# EAGLE design display driver rev B (EAGLE 9.6.1)
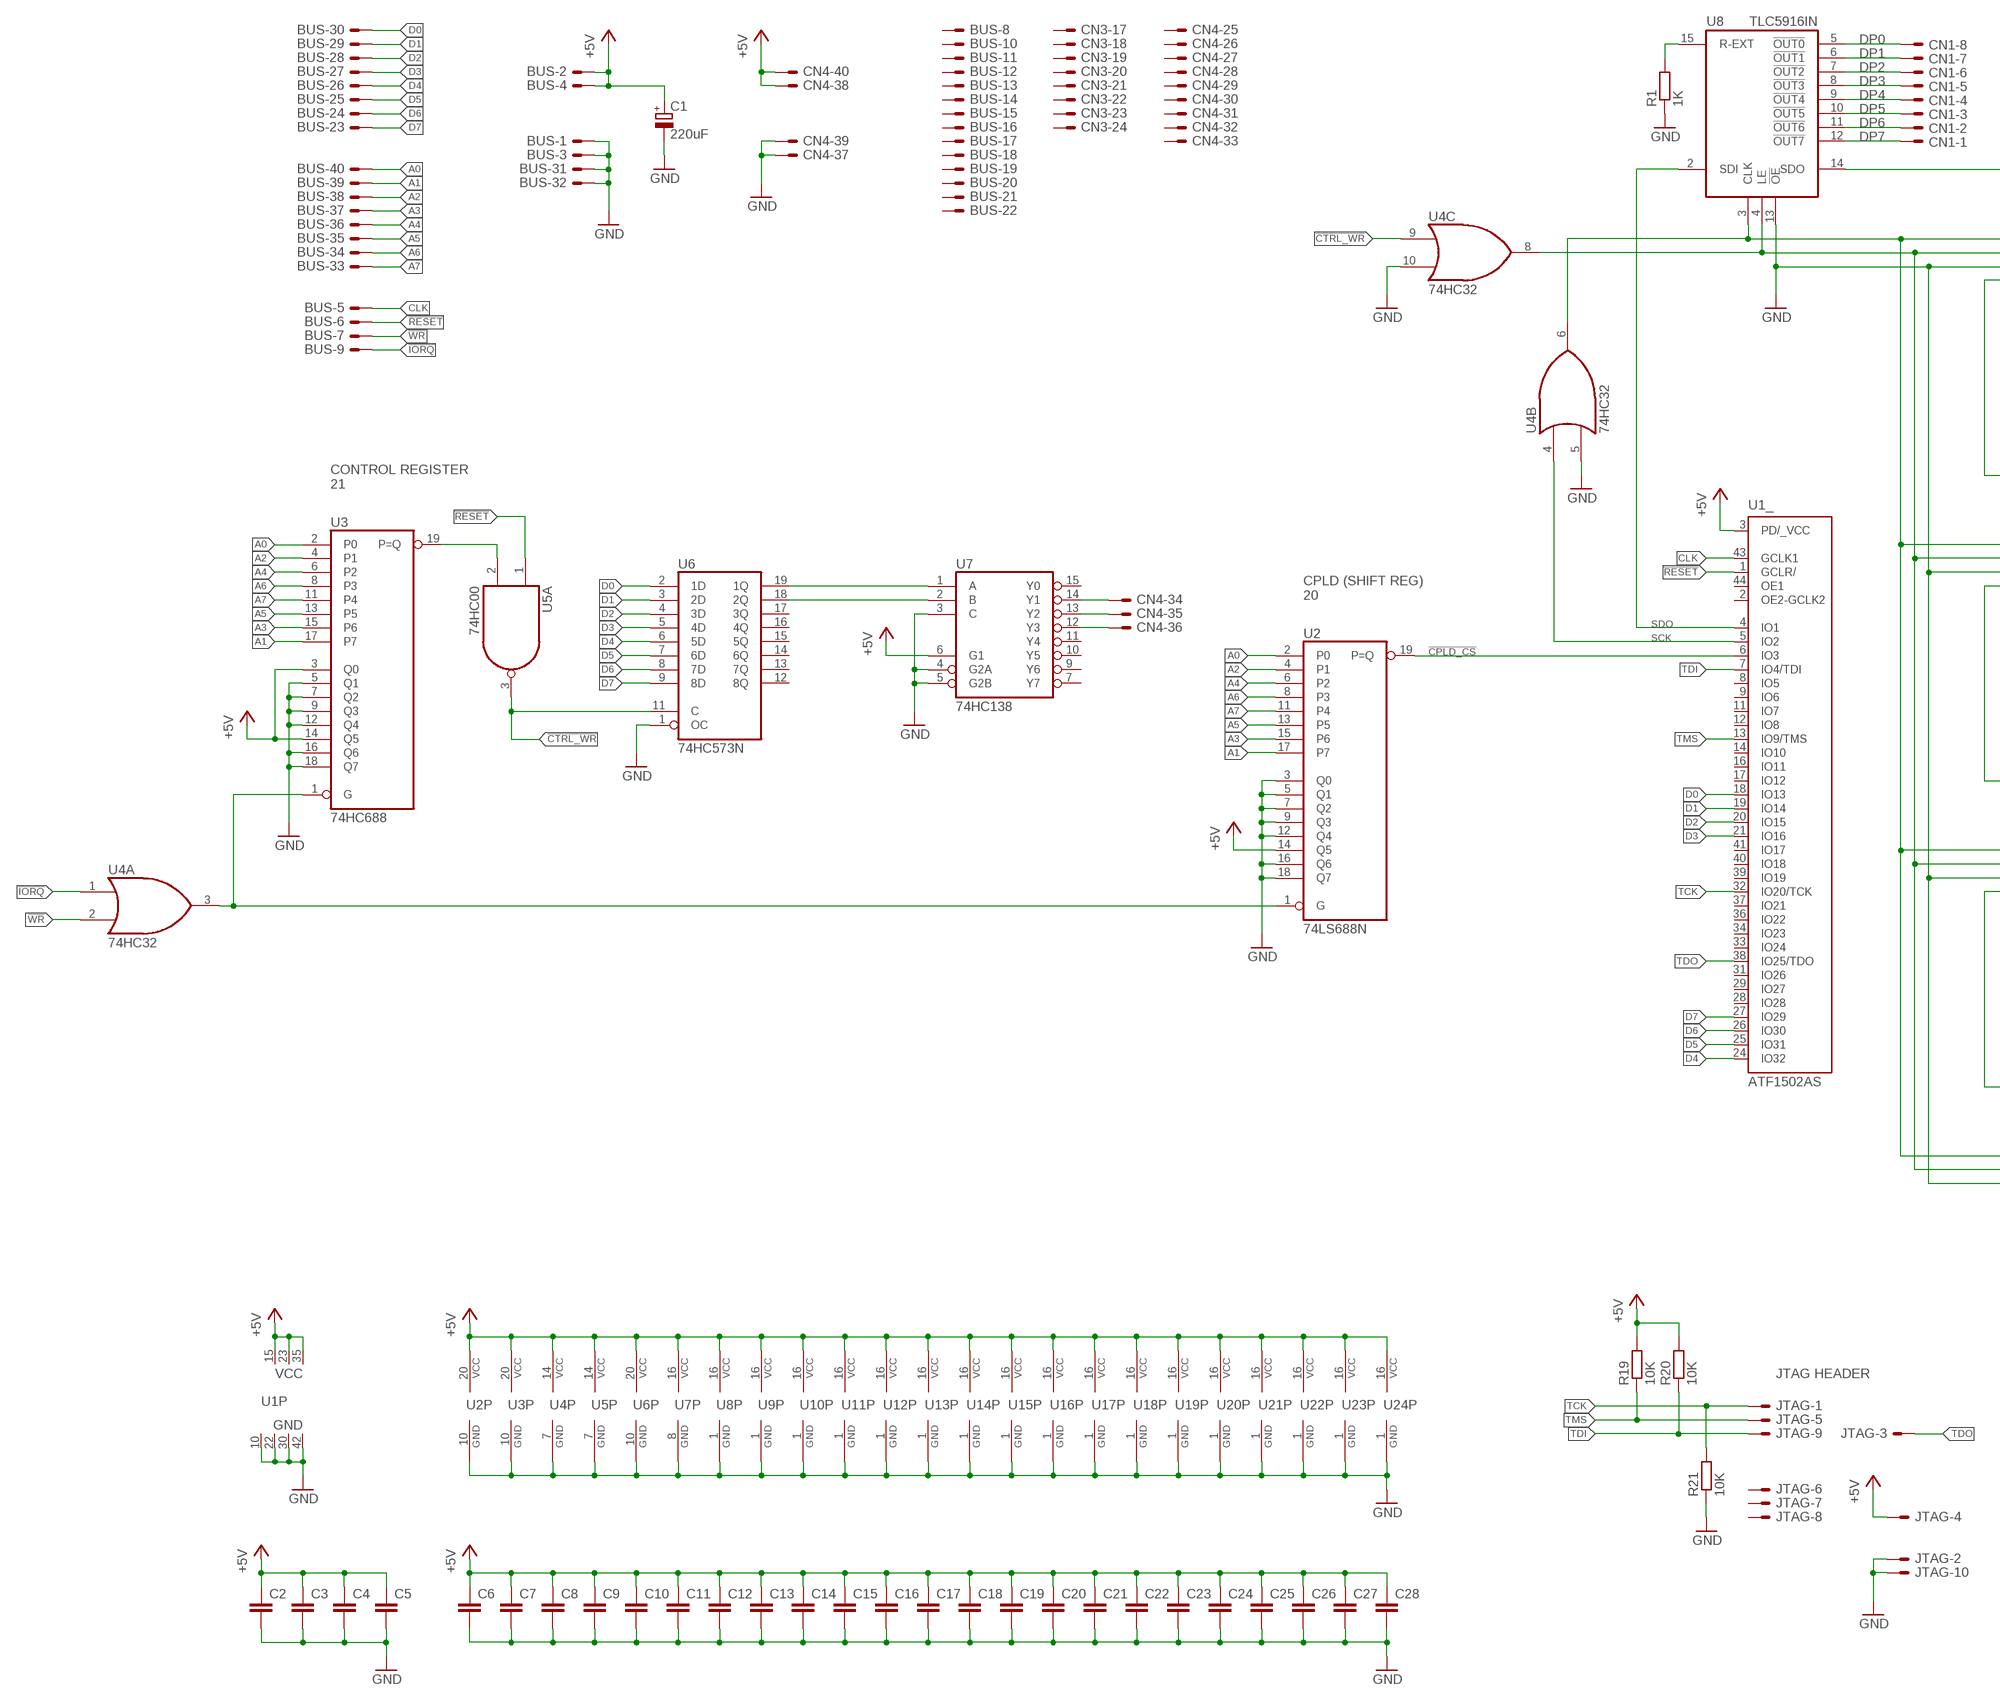
[diagram p0: schematic, sheet 1, part 1 of 2]
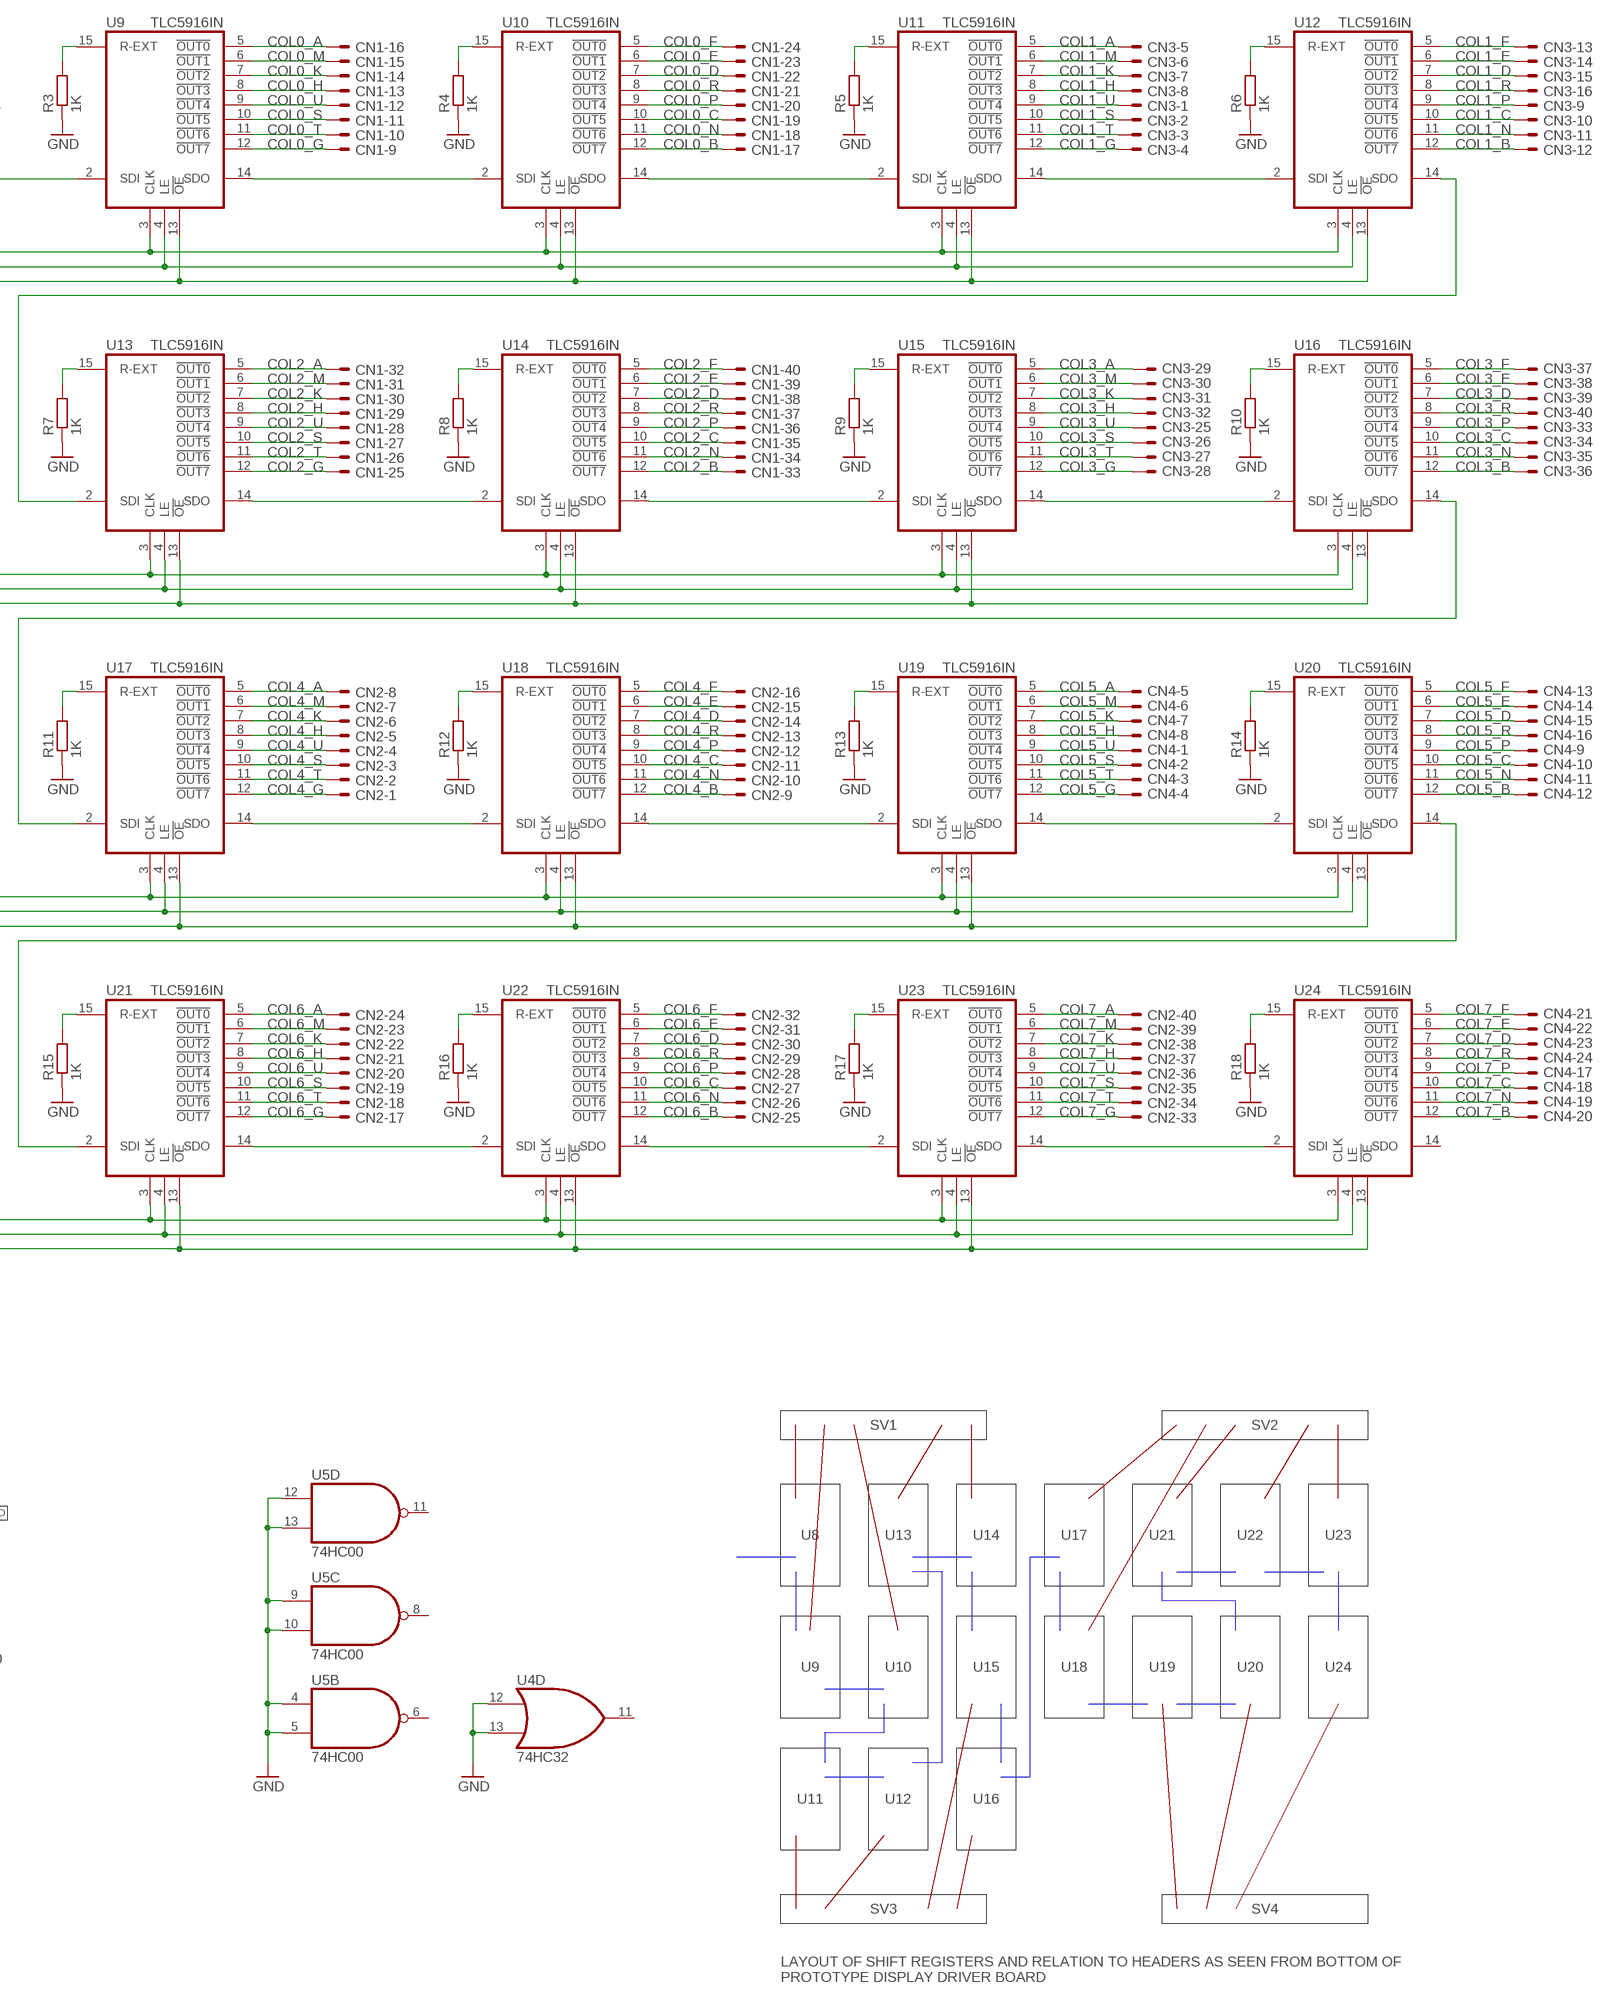
[diagram p1: schematic, sheet 1, part 2 of 2]

## Parts
BUS  HDR40  [HDR40]
C1  220uF  CPOL-EUE3.5-8  [E3,5-8]
C2  C-EU050-025X075  [C050-025X075]
C3  C-EU050-025X075  [C050-025X075]
C4  C-EU050-025X075  [C050-025X075]
C5  C-EU050-025X075  [C050-025X075]
C6  C-EU050-025X075  [C050-025X075]
C7  C-EU050-025X075  [C050-025X075]
C8  C-EU050-025X075  [C050-025X075]
C9  C-EU050-025X075  [C050-025X075]
C10  C-EU050-025X075  [C050-025X075]
C11  C-EU050-025X075  [C050-025X075]
C12  C-EU050-025X075  [C050-025X075]
C13  C-EU050-025X075  [C050-025X075]
C14  C-EU050-025X075  [C050-025X075]
C15  C-EU050-025X075  [C050-025X075]
C16  C-EU050-025X075  [C050-025X075]
C17  C-EU050-025X075  [C050-025X075]
C18  C-EU050-025X075  [C050-025X075]
C19  C-EU050-025X075  [C050-025X075]
C20  C-EU050-025X075  [C050-025X075]
C21  C-EU050-025X075  [C050-025X075]
C22  C-EU050-025X075  [C050-025X075]
C23  C-EU050-025X075  [C050-025X075]
C24  C-EU050-025X075  [C050-025X075]
C25  C-EU050-025X075  [C050-025X075]
C26  C-EU050-025X075  [C050-025X075]
C27  C-EU050-025X075  [C050-025X075]
C28  C-EU050-025X075  [C050-025X075]
CN1  HDR40  [HDR40]
CN2  HDR40  [HDR40]
CN3  HDR40  [HDR40]
CN4  HDR40  [HDR40]
JTAG  ML10E  [ML10]
R1  1K  R-EU_0207/10  [0207/10]
R3  1K  R-EU_0207/10  [0207/10]
R4  1K  R-EU_0207/10  [0207/10]
R5  1K  R-EU_0207/10  [0207/10]
R6  1K  R-EU_0207/10  [0207/10]
R7  1K  R-EU_0207/10  [0207/10]
R8  1K  R-EU_0207/10  [0207/10]
R9  1K  R-EU_0207/10  [0207/10]
R10  1K  R-EU_0207/10  [0207/10]
R11  1K  R-EU_0207/10  [0207/10]
R12  1K  R-EU_0207/10  [0207/10]
R13  1K  R-EU_0207/10  [0207/10]
R14  1K  R-EU_0207/10  [0207/10]
R15  1K  R-EU_0207/10  [0207/10]
R16  1K  R-EU_0207/10  [0207/10]
R17  1K  R-EU_0207/10  [0207/10]
R18  1K  R-EU_0207/10  [0207/10]
R19  10K  R-EU_0207/10  [0207/10]
R20  10K  R-EU_0207/10  [0207/10]
R21  10K  R-EU_0207/10  [0207/10]
U1  ATF1502AS  EPM7032S44  [PLCC-S44]
U2  74LS688N  [DIL20]
U3  74HC688  74LS688N  [DIL20]
U4  74HC32  74LS32N  [DIL14]
U5  74HC00  74LS00N  [DIL14]
U6  74HC573N  [DIL20]
U7  74HC138  74LS138N  [DIL16]
U8  TLC5916IN  [DIL16]
U9  TLC5916IN  [DIL16]
U10  TLC5916IN  [DIL16]
U11  TLC5916IN  [DIL16]
U12  TLC5916IN  [DIL16]
U13  TLC5916IN  [DIL16]
U14  TLC5916IN  [DIL16]
U15  TLC5916IN  [DIL16]
U16  TLC5916IN  [DIL16]
U17  TLC5916IN  [DIL16]
U18  TLC5916IN  [DIL16]
U19  TLC5916IN  [DIL16]
U20  TLC5916IN  [DIL16]
U21  TLC5916IN  [DIL16]
U22  TLC5916IN  [DIL16]
U23  TLC5916IN  [DIL16]
U24  TLC5916IN  [DIL16]

## Nets
!CPLD_CS!: U1.6(_:IO3) U2.19(P=Q)
!CTRL_WR!: U4.9(C:I0) U5.3(A:O) U6.11(C)
!IORQ!: BUS.9 U4.1(A:I0)
!RESET!: BUS.6 U1.1(_:GCLR/) U5.1(A:I0)
!WR!: BUS.7 U4.2(A:I1)
+5V: BUS.2 BUS.4 C1.+ C2.1 C3.1 C4.1 C5.1 C6.1 C7.1 C8.1 C9.1 C10.1 C11.1 C12.1 C13.1 C14.1 C15.1 C16.1 C17.1 C18.1 C19.1 C20.1 C21.1 C22.1 C23.1 C24.1 C25.1 C26.1 C27.1 C28.1 CN4.38 CN4.40 JTAG.4 R19.2 R20.2 U1.3(_:PD/_VCC) U1.15(P:VCC) U1.23(P:VCC) U1.35(P:VCC) U2.14(Q5) U2.20(VCC) U3.3(Q0) U3.14(Q5) U3.20(VCC) U4.14(P:VCC) U5.14(P:VCC) U6.20(VCC) U7.6(G1) U7.16(VCC) U8.16(VCC) U9.16(VCC) U10.16(VCC) U11.16(VCC) U12.16(VCC) U13.16(VCC) U14.16(VCC) U15.16(VCC) U16.16(VCC) U17.16(VCC) U18.16(VCC) U19.16(VCC) U20.16(VCC) U21.16(VCC) U22.16(VCC) U23.16(VCC) U24.16(VCC)
A0: BUS.40 U2.2(P0) U3.2(P0)
A1: BUS.39 U2.17(P7) U3.17(P7)
A2: BUS.38 U2.4(P1) U3.4(P1)
A3: BUS.37 U2.15(P6) U3.15(P6)
A4: BUS.36 U2.6(P2) U3.6(P2)
A5: BUS.35 U2.13(P5) U3.13(P5)
A6: BUS.34 U2.8(P3) U3.8(P3)
A7: BUS.33 U2.11(P4) U3.11(P4)
CLK: BUS.5 U1.43(_:GCLK1)
COL0_A: CN1.16 U9.5(!OUT0!)
COL0_B: CN1.17 U10.12(!OUT7!)
COL0_C: CN1.19 U10.10(!OUT5!)
COL0_D: CN1.22 U10.7(!OUT2!)
COL0_E: CN1.23 U10.6(!OUT1!)
COL0_F: CN1.24 U10.5(!OUT0!)
COL0_G: CN1.9 U9.12(!OUT7!)
COL0_H: CN1.13 U9.8(!OUT3!)
COL0_K: CN1.14 U9.7(!OUT2!)
COL0_M: CN1.15 U9.6(!OUT1!)
COL0_N: CN1.18 U10.11(!OUT6!)
COL0_P: CN1.20 U10.9(!OUT4!)
COL0_R: CN1.21 U10.8(!OUT3!)
COL0_S: CN1.11 U9.10(!OUT5!)
COL0_T: CN1.10 U9.11(!OUT6!)
COL0_U: CN1.12 U9.9(!OUT4!)
COL1_A: CN3.5 U11.5(!OUT0!)
COL1_B: CN3.12 U12.12(!OUT7!)
COL1_C: CN3.10 U12.10(!OUT5!)
COL1_D: CN3.15 U12.7(!OUT2!)
COL1_E: CN3.14 U12.6(!OUT1!)
COL1_F: CN3.13 U12.5(!OUT0!)
COL1_G: CN3.4 U11.12(!OUT7!)
COL1_H: CN3.8 U11.8(!OUT3!)
COL1_K: CN3.7 U11.7(!OUT2!)
COL1_M: CN3.6 U11.6(!OUT1!)
COL1_N: CN3.11 U12.11(!OUT6!)
COL1_P: CN3.9 U12.9(!OUT4!)
COL1_R: CN3.16 U12.8(!OUT3!)
COL1_S: CN3.2 U11.10(!OUT5!)
COL1_T: CN3.3 U11.11(!OUT6!)
COL1_U: CN3.1 U11.9(!OUT4!)
COL2_A: CN1.32 U13.5(!OUT0!)
COL2_B: CN1.33 U14.12(!OUT7!)
COL2_C: CN1.35 U14.10(!OUT5!)
COL2_D: CN1.38 U14.7(!OUT2!)
COL2_E: CN1.39 U14.6(!OUT1!)
COL2_F: CN1.40 U14.5(!OUT0!)
COL2_G: CN1.25 U13.12(!OUT7!)
COL2_H: CN1.29 U13.8(!OUT3!)
COL2_K: CN1.30 U13.7(!OUT2!)
COL2_M: CN1.31 U13.6(!OUT1!)
COL2_N: CN1.34 U14.11(!OUT6!)
COL2_P: CN1.36 U14.9(!OUT4!)
COL2_R: CN1.37 U14.8(!OUT3!)
COL2_S: CN1.27 U13.10(!OUT5!)
COL2_T: CN1.26 U13.11(!OUT6!)
COL2_U: CN1.28 U13.9(!OUT4!)
COL3_A: CN3.29 U15.5(!OUT0!)
COL3_B: CN3.36 U16.12(!OUT7!)
COL3_C: CN3.34 U16.10(!OUT5!)
COL3_D: CN3.39 U16.7(!OUT2!)
COL3_E: CN3.38 U16.6(!OUT1!)
COL3_F: CN3.37 U16.5(!OUT0!)
COL3_G: CN3.28 U15.12(!OUT7!)
COL3_H: CN3.32 U15.8(!OUT3!)
COL3_K: CN3.31 U15.7(!OUT2!)
COL3_M: CN3.30 U15.6(!OUT1!)
COL3_N: CN3.35 U16.11(!OUT6!)
COL3_P: CN3.33 U16.9(!OUT4!)
COL3_R: CN3.40 U16.8(!OUT3!)
COL3_S: CN3.26 U15.10(!OUT5!)
COL3_T: CN3.27 U15.11(!OUT6!)
COL3_U: CN3.25 U15.9(!OUT4!)
COL4_A: CN2.8 U17.5(!OUT0!)
COL4_B: CN2.9 U18.12(!OUT7!)
COL4_C: CN2.11 U18.10(!OUT5!)
COL4_D: CN2.14 U18.7(!OUT2!)
COL4_E: CN2.15 U18.6(!OUT1!)
COL4_F: CN2.16 U18.5(!OUT0!)
COL4_G: CN2.1 U17.12(!OUT7!)
COL4_H: CN2.5 U17.8(!OUT3!)
COL4_K: CN2.6 U17.7(!OUT2!)
COL4_M: CN2.7 U17.6(!OUT1!)
COL4_N: CN2.10 U18.11(!OUT6!)
COL4_P: CN2.12 U18.9(!OUT4!)
COL4_R: CN2.13 U18.8(!OUT3!)
COL4_S: CN2.3 U17.10(!OUT5!)
COL4_T: CN2.2 U17.11(!OUT6!)
COL4_U: CN2.4 U17.9(!OUT4!)
COL5_A: CN4.5 U19.5(!OUT0!)
COL5_B: CN4.12 U20.12(!OUT7!)
COL5_C: CN4.10 U20.10(!OUT5!)
COL5_D: CN4.15 U20.7(!OUT2!)
COL5_E: CN4.14 U20.6(!OUT1!)
COL5_F: CN4.13 U20.5(!OUT0!)
COL5_G: CN4.4 U19.12(!OUT7!)
COL5_H: CN4.8 U19.8(!OUT3!)
COL5_K: CN4.7 U19.7(!OUT2!)
COL5_M: CN4.6 U19.6(!OUT1!)
COL5_N: CN4.11 U20.11(!OUT6!)
COL5_P: CN4.9 U20.9(!OUT4!)
COL5_R: CN4.16 U20.8(!OUT3!)
COL5_S: CN4.2 U19.10(!OUT5!)
COL5_T: CN4.3 U19.11(!OUT6!)
COL5_U: CN4.1 U19.9(!OUT4!)
COL6_A: CN2.24 U21.5(!OUT0!)
COL6_B: CN2.25 U22.12(!OUT7!)
COL6_C: CN2.27 U22.10(!OUT5!)
COL6_D: CN2.30 U22.7(!OUT2!)
COL6_E: CN2.31 U22.6(!OUT1!)
COL6_F: CN2.32 U22.5(!OUT0!)
COL6_G: CN2.17 U21.12(!OUT7!)
COL6_H: CN2.21 U21.8(!OUT3!)
COL6_K: CN2.22 U21.7(!OUT2!)
COL6_M: CN2.23 U21.6(!OUT1!)
COL6_N: CN2.26 U22.11(!OUT6!)
COL6_P: CN2.28 U22.9(!OUT4!)
COL6_R: CN2.29 U22.8(!OUT3!)
COL6_S: CN2.19 U21.10(!OUT5!)
COL6_T: CN2.18 U21.11(!OUT6!)
COL6_U: CN2.20 U21.9(!OUT4!)
COL7_A: CN2.40 U23.5(!OUT0!)
COL7_B: CN4.20 U24.12(!OUT7!)
COL7_C: CN4.18 U24.10(!OUT5!)
COL7_D: CN4.23 U24.7(!OUT2!)
COL7_E: CN4.22 U24.6(!OUT1!)
COL7_F: CN4.21 U24.5(!OUT0!)
COL7_G: CN2.33 U23.12(!OUT7!)
COL7_H: CN2.37 U23.8(!OUT3!)
COL7_K: CN2.38 U23.7(!OUT2!)
COL7_M: CN2.39 U23.6(!OUT1!)
COL7_N: CN4.19 U24.11(!OUT6!)
COL7_P: CN4.17 U24.9(!OUT4!)
COL7_R: CN4.24 U24.8(!OUT3!)
COL7_S: CN2.35 U23.10(!OUT5!)
COL7_T: CN2.34 U23.11(!OUT6!)
COL7_U: CN2.36 U23.9(!OUT4!)
D0: BUS.30 U1.18(_:IO13) U6.2(1D)
D1: BUS.29 U1.19(_:IO14) U6.3(2D)
D2: BUS.28 U1.20(_:IO15) U6.4(3D)
D3: BUS.27 U1.21(_:IO16) U6.5(4D)
D4: BUS.26 U1.24(_:IO32) U6.6(5D)
D5: BUS.25 U1.25(_:IO31) U6.7(6D)
D6: BUS.24 U1.26(_:IO30) U6.8(7D)
D7: BUS.23 U1.27(_:IO29) U6.9(8D)
DP0: CN1.8 U8.5(!OUT0!)
DP1: CN1.7 U8.6(!OUT1!)
DP2: CN1.6 U8.7(!OUT2!)
DP3: CN1.5 U8.8(!OUT3!)
DP4: CN1.4 U8.9(!OUT4!)
DP5: CN1.3 U8.10(!OUT5!)
DP6: CN1.2 U8.11(!OUT6!)
DP7: CN1.1 U8.12(!OUT7!)
GND: BUS.1 BUS.3 BUS.31 BUS.32 C1.- C2.2 C3.2 C4.2 C5.2 C6.2 C7.2 C8.2 C9.2 C10.2 C11.2 C12.2 C13.2 C14.2 C15.2 C16.2 C17.2 C18.2 C19.2 C20.2 C21.2 C22.2 C23.2 C24.2 C25.2 C26.2 C27.2 C28.2 CN4.37 CN4.39 JTAG.2 JTAG.10 R1.1 R3.1 R4.1 R5.1 R6.1 R7.1 R8.1 R9.1 R10.1 R11.1 R12.1 R13.1 R14.1 R15.1 R16.1 R17.1 R18.1 R21.1 U1.10(P:GND) U1.22(P:GND) U1.30(P:GND) U1.42(P:GND) U2.3(Q0) U2.5(Q1) U2.7(Q2) U2.9(Q3) U2.10(GND) U2.12(Q4) U2.16(Q6) U2.18(Q7) U3.5(Q1) U3.7(Q2) U3.9(Q3) U3.10(GND) U3.12(Q4) U3.16(Q6) U3.18(Q7) U4.5(B:I1) U4.7(P:GND) U4.10(C:I1) U4.12(D:I0) U4.13(D:I1) U5.4(B:I0) U5.5(B:I1) U5.7(P:GND) U5.9(C:I0) U5.10(C:I1) U5.12(D:I0) U5.13(D:I1) U6.1(OC) U6.10(GND) U7.3(C) U7.4(G2A) U7.5(G2B) U7.8(GND) U8.1(GND) U8.13(!OE!) U9.1(GND) U9.13(!OE!) U10.1(GND) U10.13(!OE!) U11.1(GND) U11.13(!OE!) U12.1(GND) U12.13(!OE!) U13.1(GND) U13.13(!OE!) U14.1(GND) U14.13(!OE!) U15.1(GND) U15.13(!OE!) U16.1(GND) U16.13(!OE!) U17.1(GND) U17.13(!OE!) U18.1(GND) U18.13(!OE!) U19.1(GND) U19.13(!OE!) U20.1(GND) U20.13(!OE!) U21.1(GND) U21.13(!OE!) U22.1(GND) U22.13(!OE!) U23.1(GND) U23.13(!OE!) U24.1(GND) U24.13(!OE!)
N$1: U3.19(P=Q) U4.6(B:O) U5.2(A:I1) U8.3(CLK) U9.3(CLK) U10.3(CLK) U11.3(CLK) U12.3(CLK) U13.3(CLK) U14.3(CLK) U15.3(CLK) U16.3(CLK) U17.3(CLK) U18.3(CLK) U19.3(CLK) U20.3(CLK) U21.3(CLK) U22.3(CLK) U23.3(CLK) U24.3(CLK)
N$3: CN4.34 U7.14(Y1)
N$4: U6.19(1Q) U7.1(A)
N$5: U6.18(2Q) U7.2(B)
N$6: CN4.35 U7.13(Y2)
N$7: CN4.36 U7.12(Y3)
N$8: R1.2 U8.15(R-EXT)
N$17: R3.2 U9.15(R-EXT)
N$18: R4.2 U10.15(R-EXT)
N$19: R5.2 U11.15(R-EXT)
N$20: R6.2 U12.15(R-EXT)
N$21: R7.2 U13.15(R-EXT)
N$22: R8.2 U14.15(R-EXT)
N$23: R9.2 U15.15(R-EXT)
N$24: R10.2 U16.15(R-EXT)
N$25: R11.2 U17.15(R-EXT)
N$26: R12.2 U18.15(R-EXT)
N$27: R13.2 U19.15(R-EXT)
N$28: R14.2 U20.15(R-EXT)
N$29: R15.2 U21.15(R-EXT)
N$30: R16.2 U22.15(R-EXT)
N$31: R17.2 U23.15(R-EXT)
N$32: R18.2 U24.15(R-EXT)
N$33: U8.14(SDO) U9.2(SDI)
N$34: U9.14(SDO) U10.2(SDI)
N$35: U10.14(SDO) U11.2(SDI)
N$36: U11.14(SDO) U12.2(SDI)
N$37: U13.14(SDO) U14.2(SDI)
N$38: U14.14(SDO) U15.2(SDI)
N$39: U15.14(SDO) U16.2(SDI)
N$40: U17.14(SDO) U18.2(SDI)
N$41: U18.14(SDO) U19.2(SDI)
N$42: U19.14(SDO) U20.2(SDI)
N$43: U21.14(SDO) U22.2(SDI)
N$44: U22.14(SDO) U23.2(SDI)
N$45: U23.14(SDO) U24.2(SDI)
N$53: U4.8(C:O) U8.4(LE) U9.4(LE) U10.4(LE) U11.4(LE) U12.4(LE) U13.4(LE) U14.4(LE) U15.4(LE) U16.4(LE) U17.4(LE) U18.4(LE) U19.4(LE) U20.4(LE) U21.4(LE) U22.4(LE) U23.4(LE) U24.4(LE)
N$55: U12.14(SDO) U13.2(SDI)
N$56: U16.14(SDO) U17.2(SDI)
N$57: U20.14(SDO) U21.2(SDI)
N$177: U2.1(G) U3.1(G) U4.3(A:O)
SCK: U1.5(_:IO2) U4.4(B:I0)
SDO: U1.4(_:IO1) U8.2(SDI)
TCK: JTAG.1 R21.2 U1.32(_:IO20/TCK)
TDI: JTAG.9 R20.1 U1.7(_:IO4/TDI)
TDO: JTAG.3 U1.38(_:IO25/TDO)
TMS: JTAG.5 R19.1 U1.13(_:IO9/TMS)
Unconnected: BUS.8 BUS.10 BUS.11 BUS.12 BUS.13 BUS.14 BUS.15 BUS.16 BUS.17 BUS.18 BUS.19 BUS.20 BUS.21 BUS.22 CN3.17 CN3.18 CN3.19 CN3.20 CN3.21 CN3.22 CN3.23 CN3.24 CN4.25 CN4.26 CN4.27 CN4.28 CN4.29 CN4.30 CN4.31 CN4.32 CN4.33 JTAG.6 JTAG.7 JTAG.8 U1.2(_:OE2-GCLK2) U1.8(_:IO5) U1.9(_:IO6) U1.11(_:IO7) U1.12(_:IO8) U1.14(_:IO10) U1.16(_:IO11) U1.17(_:IO12) U1.28(_:IO28) U1.29(_:IO27) U1.31(_:IO26) U1.33(_:IO24) U1.34(_:IO23) U1.36(_:IO22) U1.37(_:IO21) U1.39(_:IO19) U1.40(_:IO18) U1.41(_:IO17) U1.44(_:OE1) U4.11(D:O) U5.6(B:O) U5.8(C:O) U5.11(D:O) U6.12(8Q) U6.13(7Q) U6.14(6Q) U6.15(5Q) U6.16(4Q) U6.17(3Q) U7.7(Y7) U7.9(Y6) U7.10(Y5) U7.11(Y4) U7.15(Y0) U24.14(SDO)

## Notes on the sheet
- CONTROL REGISTER
  21
- CPLD (SHIFT REG)
  20
- SV1 | SV2
- JTAG HEADER
- U8 | U13 | U14 | U17 | U21 | U22 | U23
- U9 | U10 | U15 | U18 | U19 | U20 | U24
- U11 | U12 | U16
- SV3 | SV4
- LAYOUT OF SHIFT REGISTERS AND RELATION TO HEADERS AS SEEN FROM BOTTOM OF
  PROTOTYPE DISPLAY DRIVER BOARD

## Library data of the parts
BUS CN1-CN4 = Z80 clock:HDR40
C1 = rcl:CPOL-EU: POLARIZED CAPACITOR, European symbol
C2-C28 = rcl:C-EU: CAPACITOR, European symbol
JTAG = con-ml:ML10E: HARTING; OC_FARNELL: unknown; OC_NEWARK: unknown
R1 R3-R21 = rcl:R-EU_: RESISTOR, European symbol
U1 = altera:EPM7032: EPM7032 MAX 7000 family; MPN: EPM7032SLC44-6N; OC_FARNELL: 1549447; OC_NEWARK: 51R9532
U2 U3 = 74xx-us:74*688: 8-bit MAGNITUDE/IDENTITY COMPARATOR, totem pole
U4 = 74xx-us:74*32: Quad 2-input OR gate
U5 = 74xx-us:74*00: Quad 2-input NAND gate
U6 = 74xx-us:74*573: 8-bit D latch BUS DRIVER
U7 = 74xx-us:74*138: 3-line to 8-line DECODER/DEMULTIPLEXER
U8-U24 = Z80 clock:TLC5916I

## Board
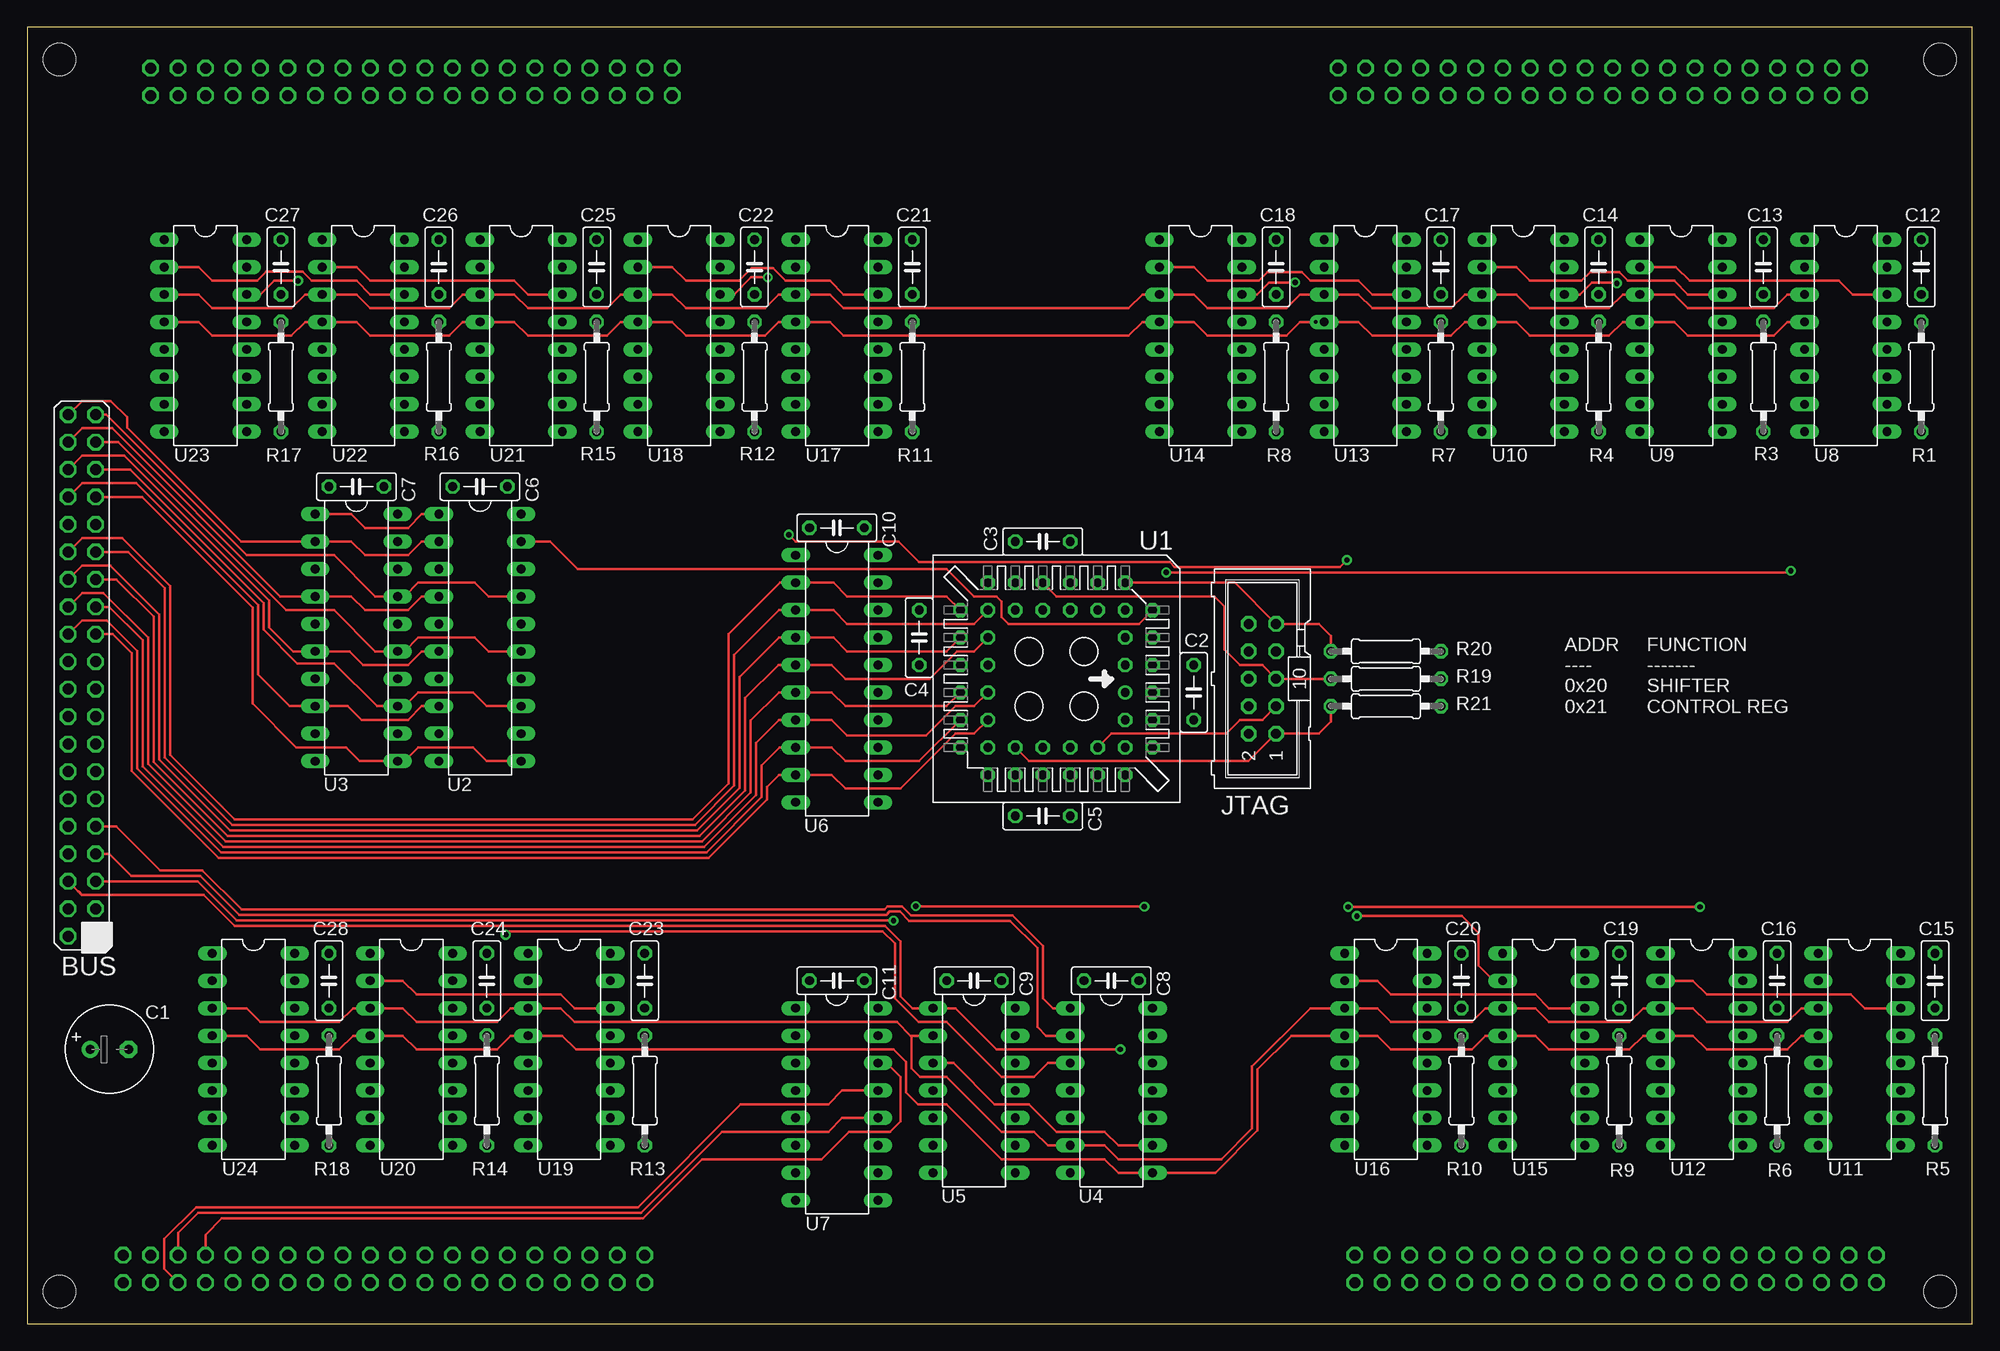
[diagram p2: board, top side]
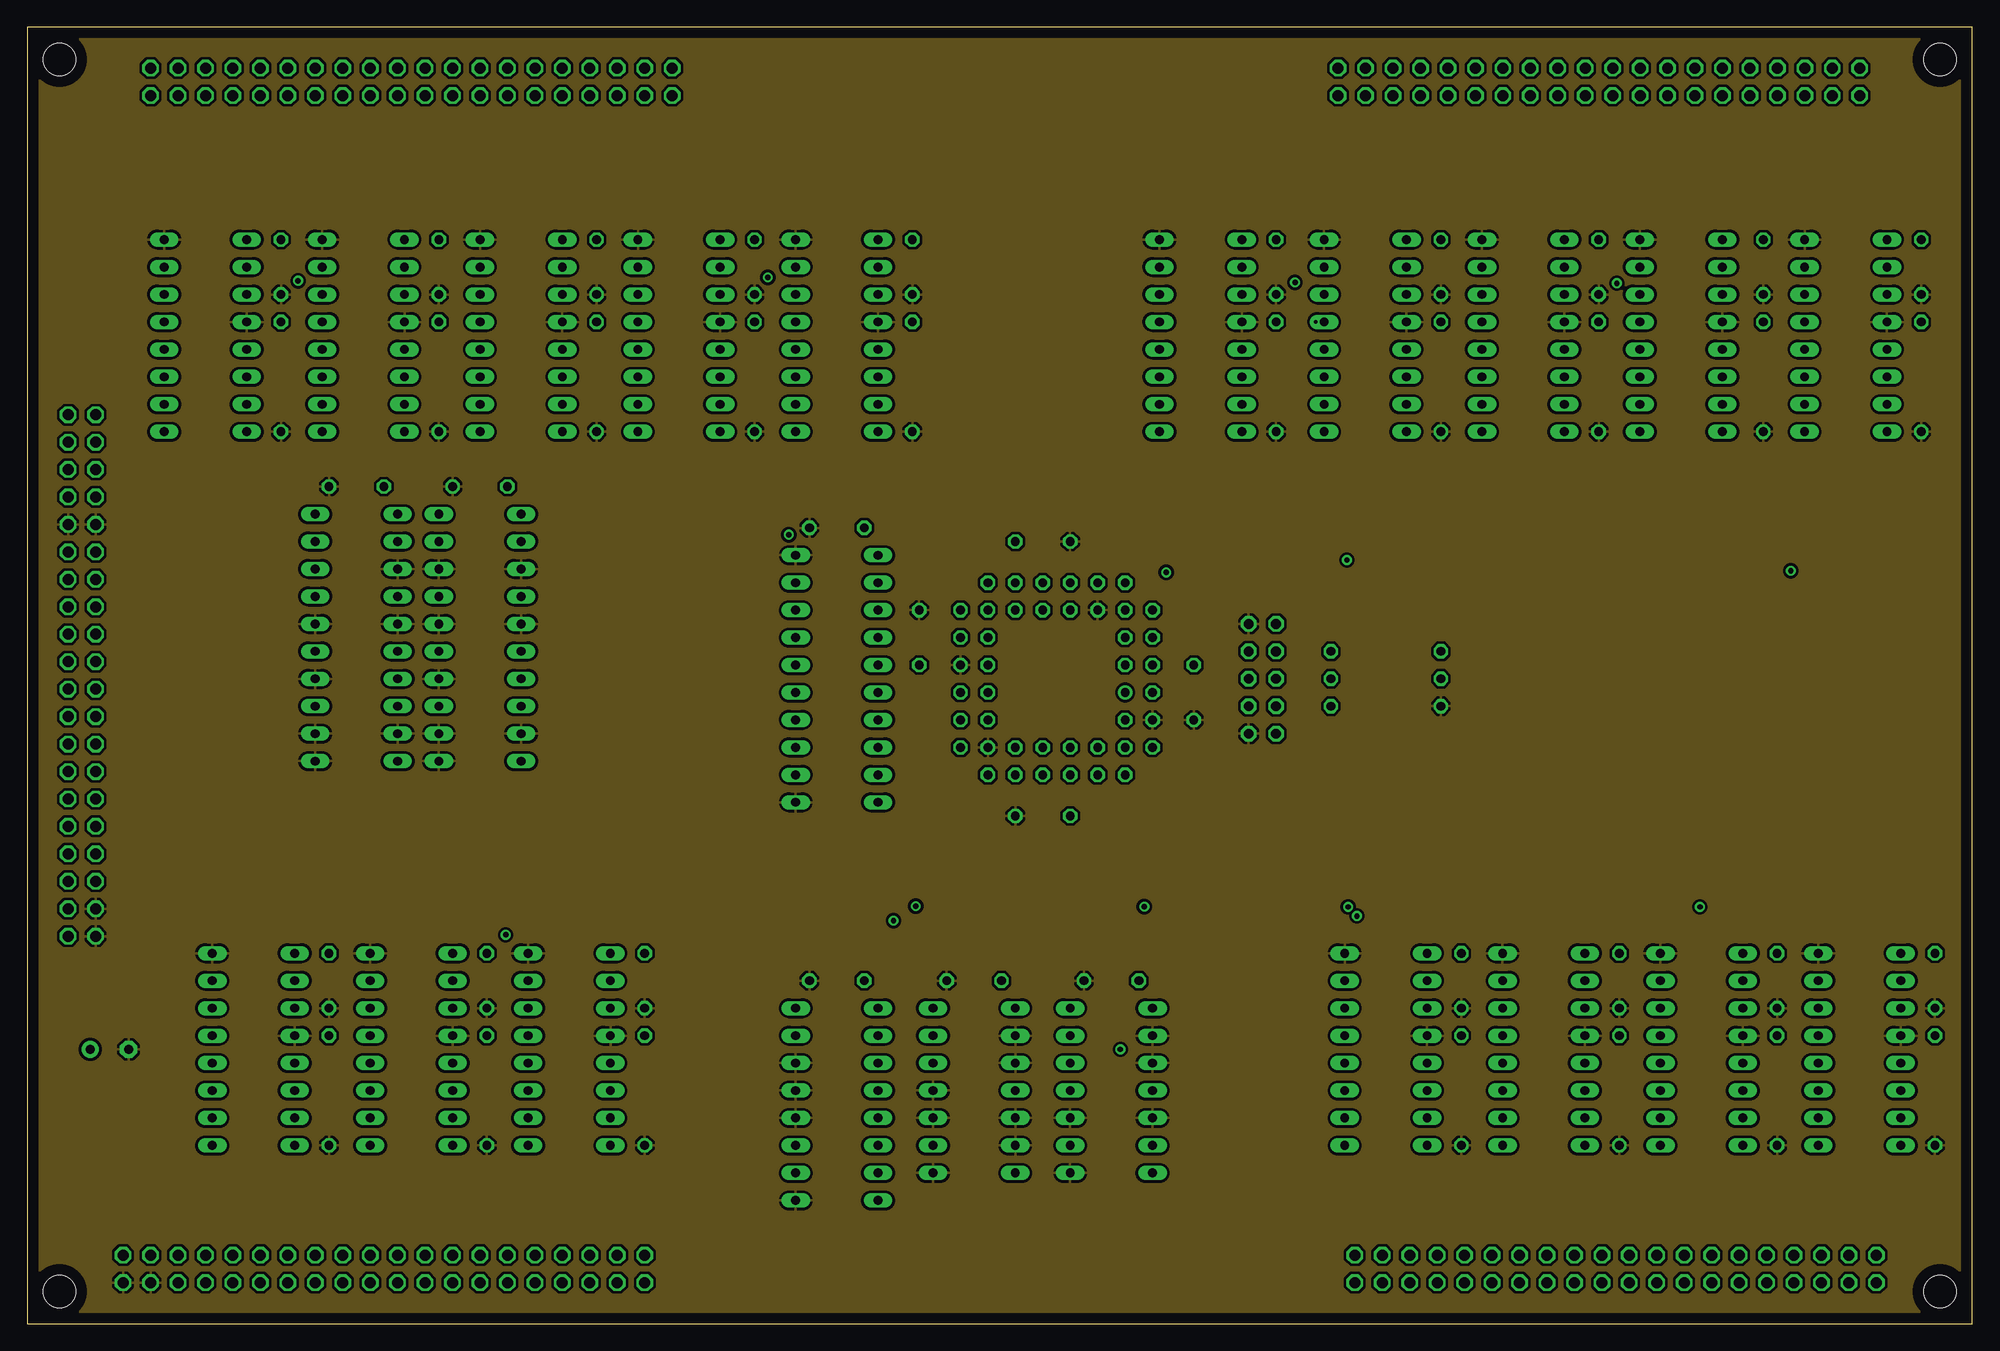
[diagram p3: board, inner layer Route2]
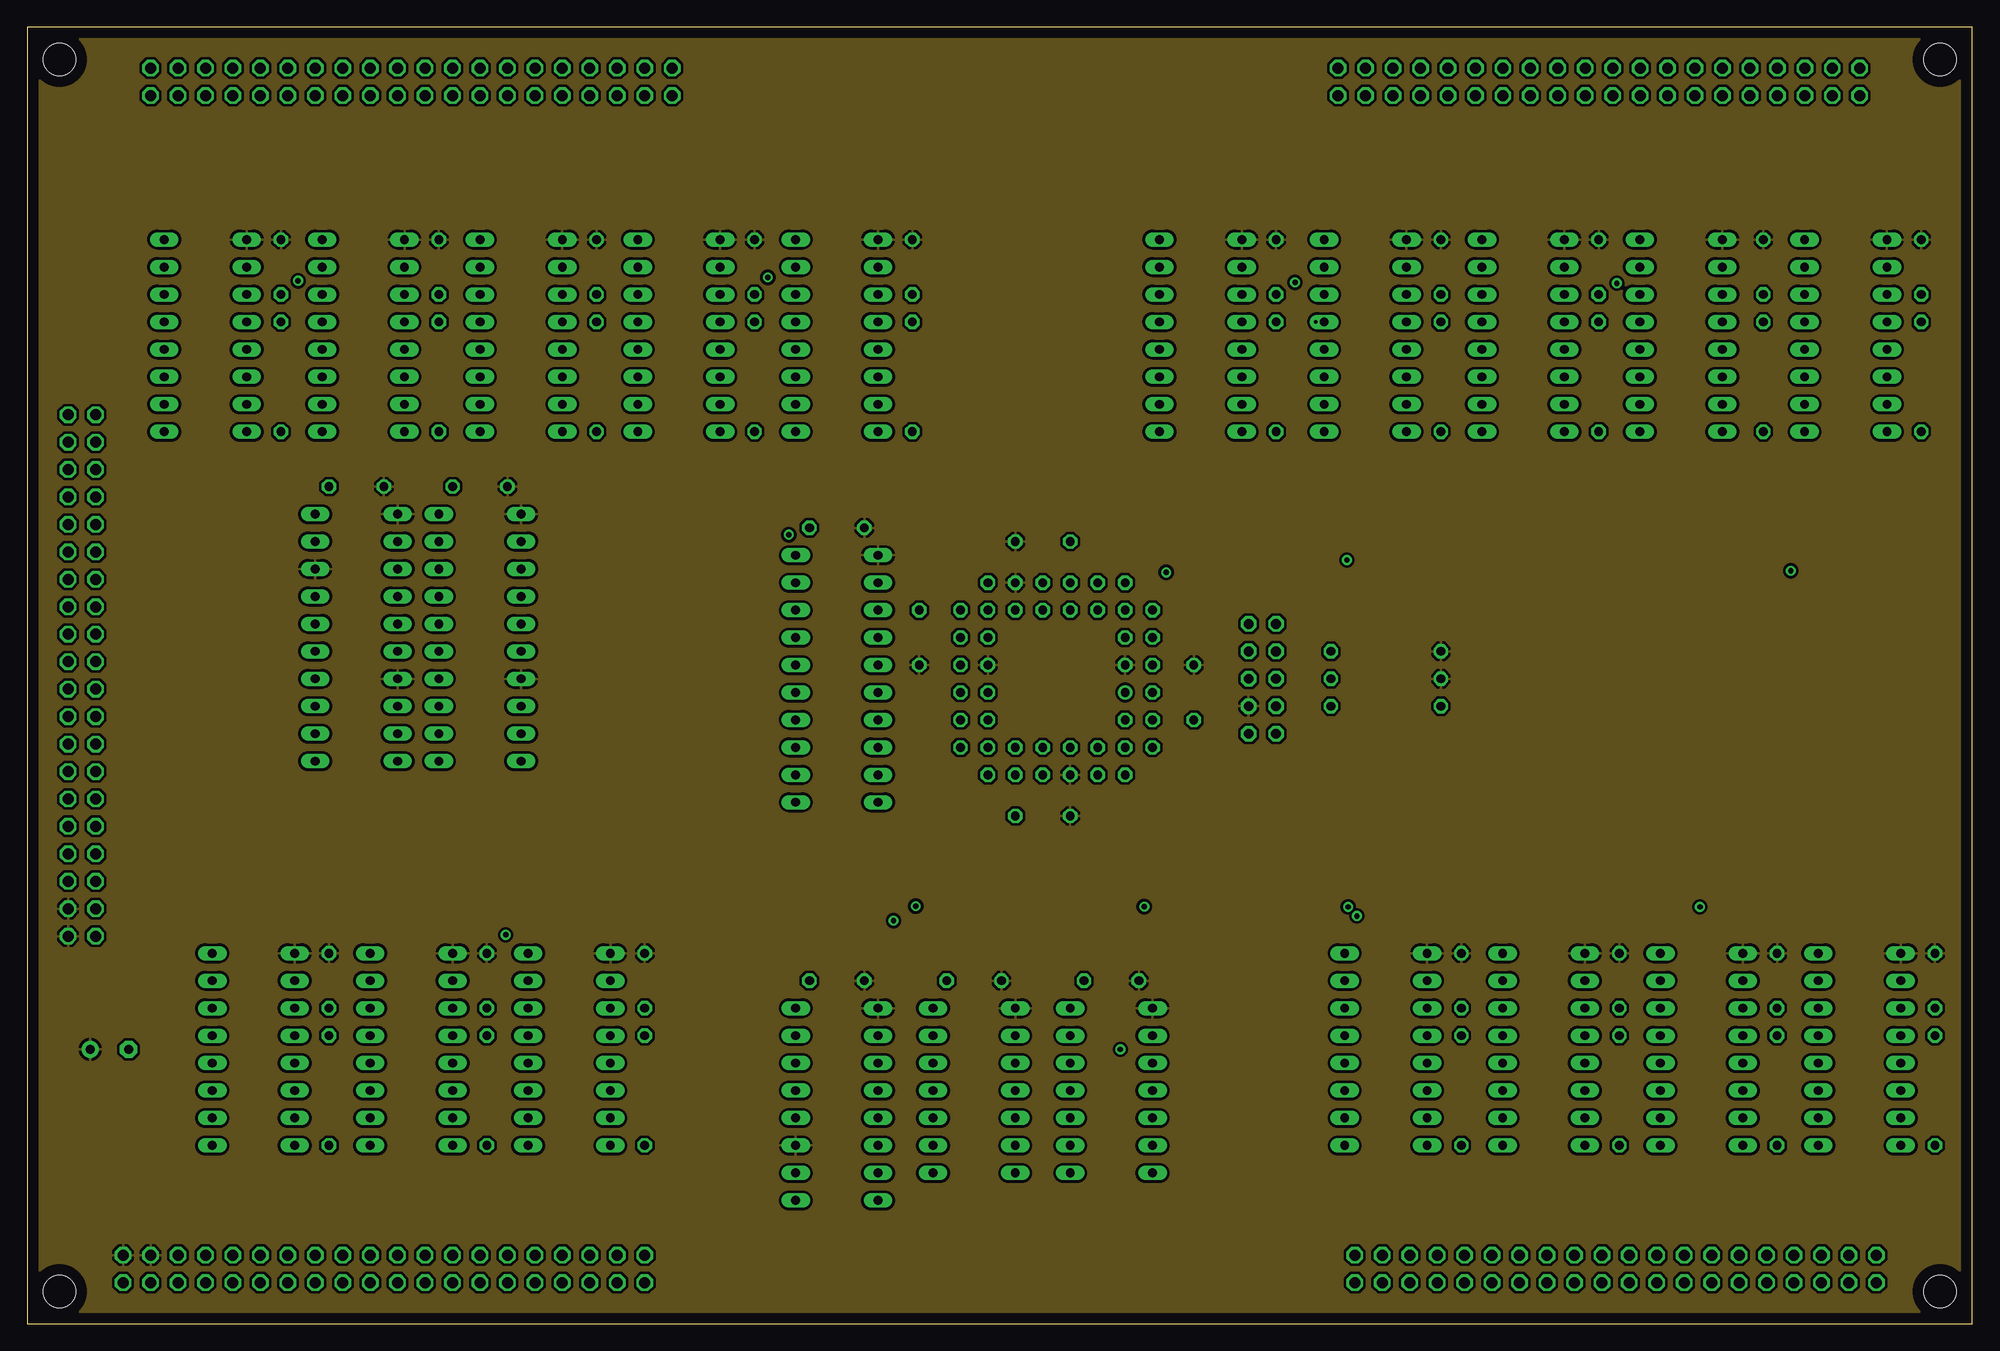
[diagram p4: board, inner layer Route3]
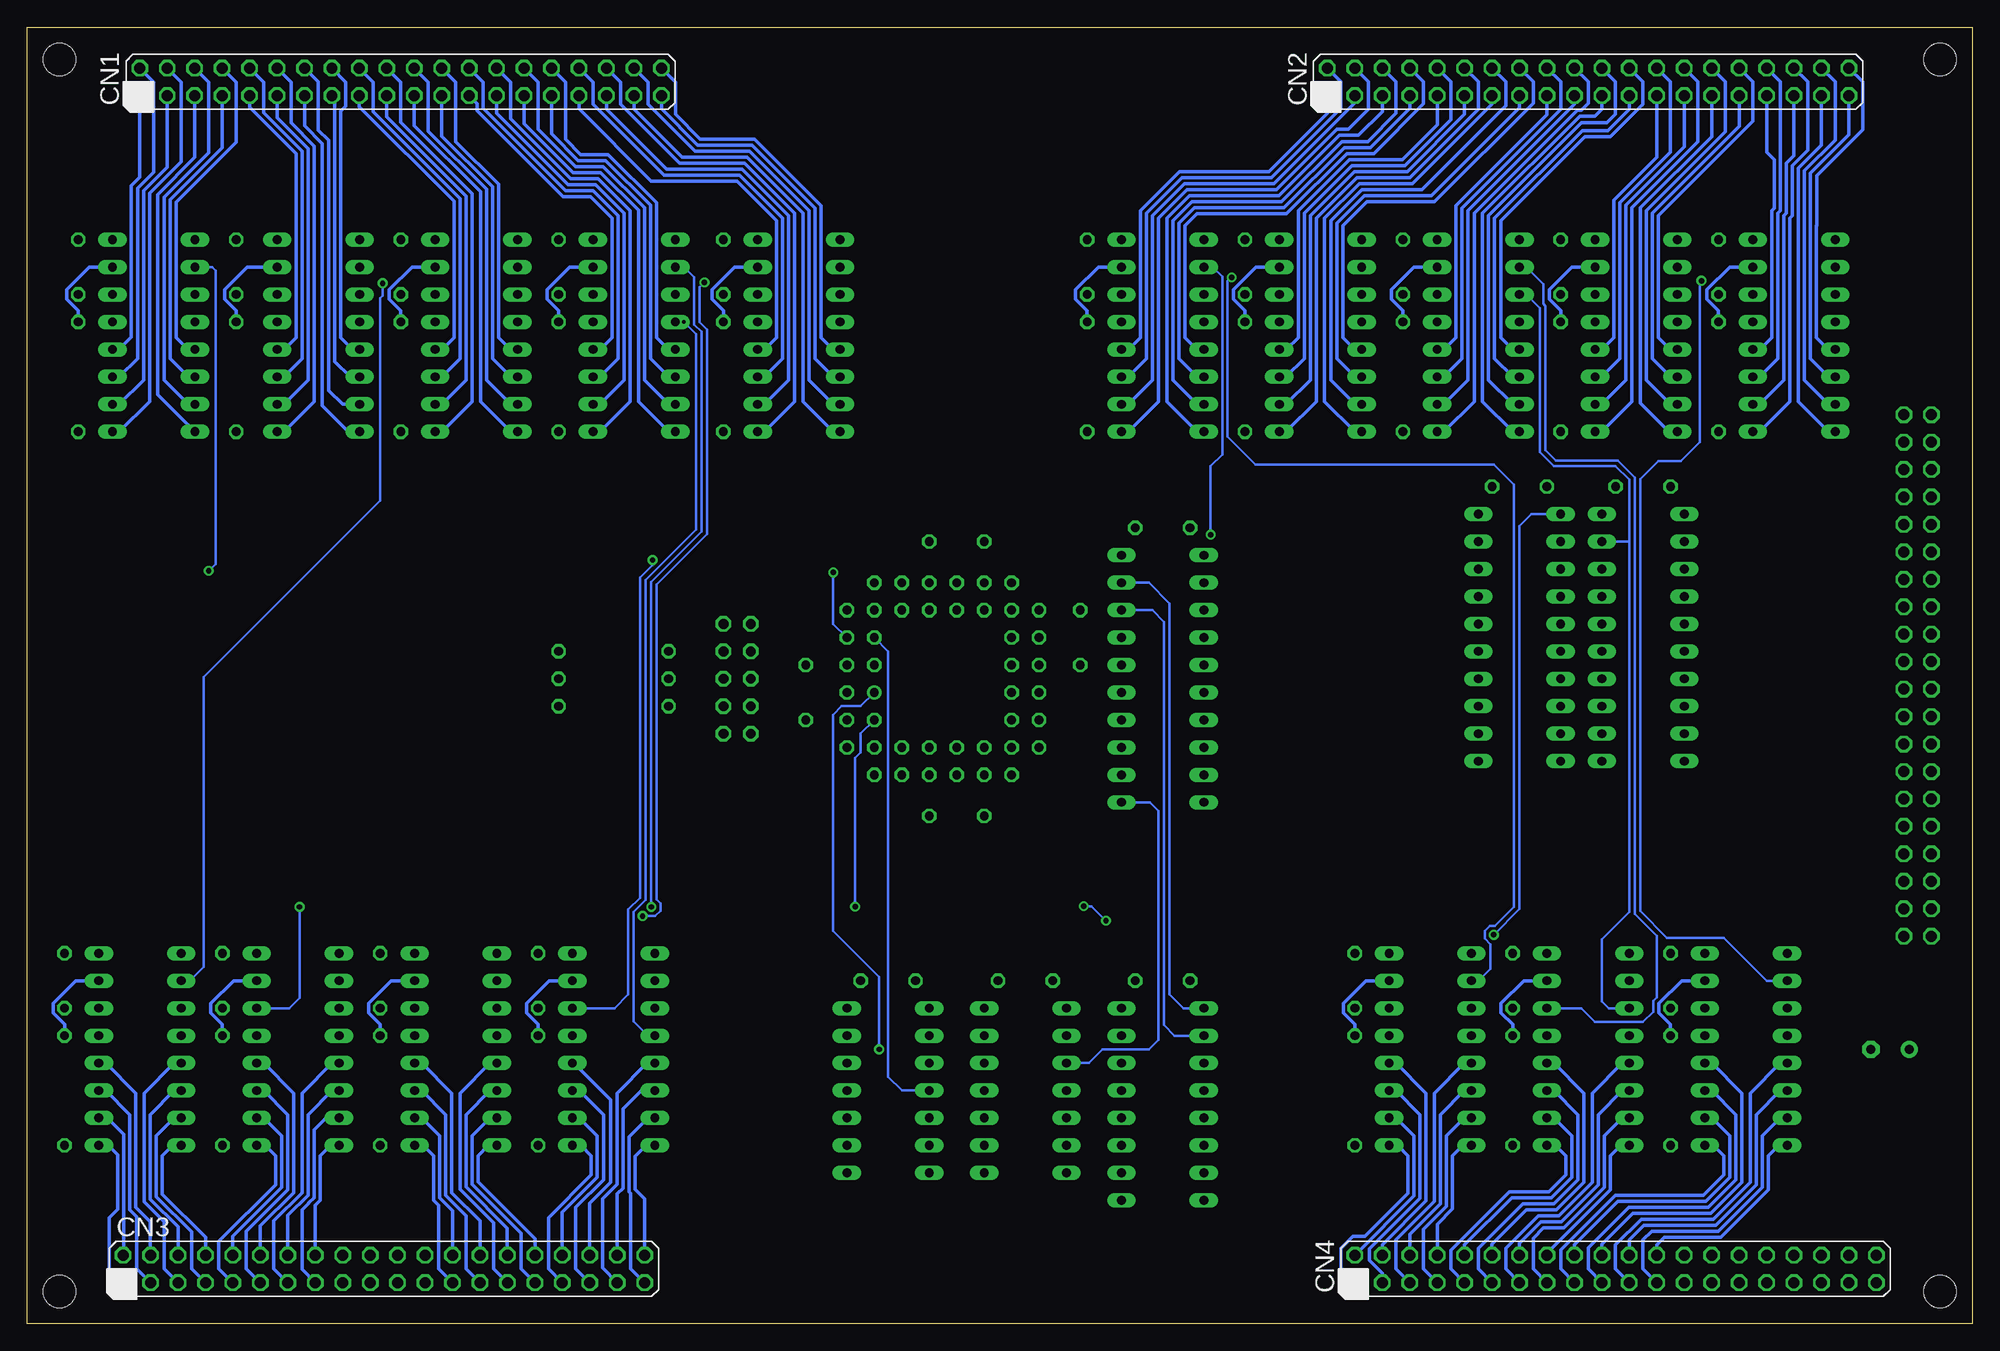
[diagram p5: board, bottom side, seen from below]

Size 180 x 120 mm. Coordinates in mm from the lower left corner, seen from the top.
Outline: 0,0 180,0 180,120 0,120 0,0
Copper layers (1*2*3*16): Top 0.035mm / dielectric 1.5mm / Route2 0.035mm / dielectric 0.15mm / Route3 0.035mm / dielectric 0.2mm / Bottom 0.035mm
Design rules "default *": minimum track width 10mil, minimum drill 0.35mm, track to track 10mil, track to pad 10mil, pad to pad 10mil, via to via 10mil, smd to smd 10mil, copper to edge 40mil, drill to drill 6mil, minimum pad ring 10mil, minimum via ring 8mil, stop-mask expansion 4mil, vias tented up to drill 20mil, thermal gap 10mil
Holes 3 mm at 3,117 3,3 177,3 177,117

### Footprints (pad centres in the part's own frame; a part is rotated, then mirrored left to right if it is on the bottom)
HDR40 = drill 1.016 octagon: 1 -24.13,-1.27; 2 -24.13,1.27; 3 -21.59,-1.27; 4 -21.59,1.27; 5 -19.05,-1.27; 6 -19.05,1.27; 7 -16.51,-1.27; 8 -16.51,1.27; 9 -13.97,-1.27; 10 -13.97,1.27; 11 -11.43,-1.27; 12 -11.43,1.27; 13 -8.89,-1.27; 14 -8.89,1.27; 15 -6.35,-1.27; 16 -6.35,1.27; 17 -3.81,-1.27; 18 -3.81,1.27; 19 -1.27,-1.27; 20 -1.27,1.27; 21 1.27,-1.27; 22 1.27,1.27; 23 3.81,-1.27; 24 3.81,1.27; 25 6.35,-1.27; 26 6.35,1.27; 27 8.89,-1.27; 28 8.89,1.27; 29 11.43,-1.27; 30 11.43,1.27; 31 13.97,-1.27; 32 13.97,1.27; 33 16.51,-1.27; 34 16.51,1.27; 35 19.05,-1.27; 36 19.05,1.27; 37 21.59,-1.27; 38 21.59,1.27; 39 24.13,-1.27; 40 24.13,1.27
E3,5-8 = drill 0.813 pad 1.6: + -1.778,0 | drill 0.813 pad 1.6 octagon: - 1.778,0
C050-025X075 = drill 0.813 octagon: 1 -2.54,0; 2 2.54,0
ML10 = drill 0.914 octagon: 1 -5.08,-1.27; 2 -5.08,1.27; 3 -2.54,-1.27; 4 -2.54,1.27; 5 0,-1.27; 6 0,1.27; 7 2.54,-1.27; 8 2.54,1.27; 9 5.08,-1.27; 10 5.08,1.27
0207/10 = drill 0.813 octagon: 1 -5.08,0; 2 5.08,0
PLCC-S44 = drill 0.813: 1 1.27,6.35 | drill 0.813 octagon: 2 -1.27,8.89; 3 -1.27,6.35; 4 -3.81,8.89; 5 -3.81,6.35; 6 -6.35,8.89; 7 -8.89,6.35; 8 -6.35,6.35; 9 -8.89,3.81; 10 -6.35,3.81; 11 -8.89,1.27; 12 -6.35,1.27; 13 -8.89,-1.27; 14 -6.35,-1.27; 15 -8.89,-3.81; 16 -6.35,-3.81; 17 -8.89,-6.35; 18 -6.35,-8.89; 19 -6.35,-6.35; 20 -3.81,-8.89; 21 -3.81,-6.35; 22 -1.27,-8.89; 23 -1.27,-6.35; 24 1.27,-8.89; 25 1.27,-6.35; 26 3.81,-8.89; 27 3.81,-6.35; 28 6.35,-8.89; 29 8.89,-6.35; 30 6.35,-6.35; 31 8.89,-3.81; 32 6.35,-3.81; 33 8.89,-1.27; 34 6.35,-1.27; 35 8.89,1.27; 36 6.35,1.27; 37 8.89,3.81; 38 6.35,3.81; 39 8.89,6.35; 40 6.35,8.89; 41 6.35,6.35; 42 3.81,8.89; 43 3.81,6.35; 44 1.27,8.89
DIL20 = drill 0.813 long: 1 -11.43,-3.81; 2 -8.89,-3.81; 3 -6.35,-3.81; 4 -3.81,-3.81; 5 -1.27,-3.81; 6 1.27,-3.81; 7 3.81,-3.81; 8 6.35,-3.81; 9 8.89,-3.81; 10 11.43,-3.81; 11 11.43,3.81; 12 8.89,3.81; 13 6.35,3.81; 14 3.81,3.81; 15 1.27,3.81; 16 -1.27,3.81; 17 -3.81,3.81; 18 -6.35,3.81; 19 -8.89,3.81; 20 -11.43,3.81
DIL14 = drill 0.813 long: 1 -7.62,-3.81; 2 -5.08,-3.81; 3 -2.54,-3.81; 4 0,-3.81; 5 2.54,-3.81; 6 5.08,-3.81; 7 7.62,-3.81; 8 7.62,3.81; 9 5.08,3.81; 10 2.54,3.81; 11 0,3.81; 12 -2.54,3.81; 13 -5.08,3.81; 14 -7.62,3.81
DIL16 = drill 0.813 long: 1 -8.89,-3.81; 2 -6.35,-3.81; 3 -3.81,-3.81; 4 -1.27,-3.81; 5 1.27,-3.81; 6 3.81,-3.81; 7 6.35,-3.81; 8 8.89,-3.81; 9 8.89,3.81; 10 6.35,3.81; 11 3.81,3.81; 12 1.27,3.81; 13 -1.27,3.81; 14 -3.81,3.81; 15 -6.35,3.81; 16 -8.89,3.81

### Placement (x,y rotation side)
BUS  5.08,60 90 top
C1  7.62,25.4 0 top
C2  107.95,58.42 270 top
C3  93.98,72.39 0 top
C4  82.55,63.5 90 top
C5  93.98,46.99 180 top
C6  41.91,77.47 180 top
C7  30.48,77.47 180 top
C8  100.33,31.75 180 top
C9  87.63,31.75 180 top
C10  74.93,73.66 180 top
C11  74.93,31.75 180 top
C12  175.26,97.79 270 top
C13  160.66,97.79 270 top
C14  145.41,97.79 270 top
C15  176.53,31.75 270 top
C16  161.93,31.75 270 top
C17  130.81,97.79 270 top
C18  115.57,97.79 270 top
C19  147.32,31.75 270 top
C20  132.72,31.75 270 top
C21  81.92,97.79 270 top
C22  67.31,97.79 270 top
C23  57.15,31.75 270 top
C24  42.55,31.75 270 top
C25  52.7,97.79 270 top
C26  38.1,97.79 270 top
C27  23.5,97.79 270 top
C28  27.94,31.75 270 top
CN1  145.44,114.92 0 bottom
CN2  35.56,114.92 0 bottom
CN3  146.98,5.08 0 bottom
CN4  33.02,5.08 0 bottom
JTAG  114.3,59.69 90 top
R1  175.26,87.63 90 top
R3  160.66,87.63 90 top
R4  145.41,87.63 90 top
R5  176.53,21.59 90 top
R6  161.93,21.59 90 top
R7  130.81,87.63 90 top
R8  115.57,87.63 90 top
R9  147.32,21.59 90 top
R10  132.72,21.59 90 top
R11  81.92,87.63 90 top
R12  67.31,87.63 90 top
R13  57.15,21.59 90 top
R14  42.55,21.59 90 top
R15  52.7,87.63 90 top
R16  38.1,87.63 90 top
R17  23.5,87.63 90 top
R18  27.94,21.59 90 top
R19  125.73,59.69 0 top
R20  125.73,62.23 0 top
R21  125.73,57.15 180 top
U1  95.25,59.69 270 top
U2  41.91,63.5 270 top
U3  30.48,63.5 270 top
U4  100.33,21.59 270 top
U5  87.63,21.59 270 top
U6  74.93,59.69 270 top
U7  74.93,20.32 270 top
U8  168.28,91.44 270 top
U9  153.03,91.44 270 top
U10  138.43,91.44 270 top
U11  169.54,25.4 270 top
U12  154.94,25.4 270 top
U13  123.83,91.44 270 top
U14  108.58,91.44 270 top
U15  140.34,25.4 270 top
U16  125.73,25.4 270 top
U17  74.93,91.44 270 top
U18  60.33,91.44 270 top
U19  50.16,25.4 270 top
U20  35.56,25.4 270 top
U21  45.72,91.44 270 top
U22  31.11,91.44 270 top
U23  16.51,91.44 270 top
U24  20.95,25.4 270 top

### Tracks (layer width: path | path; a pad name or v marks a point on that pad's centre or on a via)
!CPLD_CS!
  Top 0.254: U1.6 102.87,64.77 90.81,64.77 90.17,65.41 90.17,66.83 89.69,67.31 87.63,67.31 85.09,69.85 50.96,69.85 48.42,72.39 U2.19
!CTRL_WR!
  Top 0.254: U4.9 100.97,16.51 99.69,17.78 95.25,17.78 92.71,20.32 89.53,20.32 85.72,24.13 U5.3
  Bottom 0.254: U6.11 76.11,48.26 75.31,47.47 75.31,26.29 76.2,25.4 80.49,25.4 81.76,24.13 U5.3
!IORQ!
  Top 0.254: BUS.9 8.26,46.03 12.33,41.97 16.23,41.97 19.84,38.35 79.32,38.35 79.61,38.65 80.97,38.65 81.81,37.81 91.17,37.81 94.01,34.98 94.01,30.13 94.93,29.21 U4.1
!RESET!  (via drill 0.5)
  Top 0.254: BUS.6 4.75,40.01 4.76,40.01 5.08,39.69 16.35,39.69 19.21,36.83 79.38,36.83 80.8,35.4 80.8,30.32 81.92,29.21 U5.1 85.88,29.21 89.69,25.4 v101.16,25.4
  Bottom 0.254: U1.1 102.87,57.15 104.62,57.15 105.41,56.36 105.41,36.35 101.16,32.11 v101.16,25.4
!WR!
  Top 0.254: BUS.7 7.63,43.49 9.66,41.46 16.02,41.46 19.63,37.85 79.53,37.85 79.82,38.14 80.76,38.14 81.6,37.31 90.96,37.31 93.5,34.77 93.5,27.46 94.3,26.67 U4.2
+5V
  pour Route3: -11.43,132.08 194.31,132.08 194.31,-10.16 -11.43,-10.16
A0
  Top 0.254: BUS.40 5.09,85.41 7.73,85.41 9.25,83.88 9.25,82.93 19.79,72.39 U3.2 30,72.39 31.27,71.12 35.24,71.12 36.51,72.39 U2.2
A1
  Top 0.254: BUS.39 7.33,84.13 20.34,71.12 28.42,71.12 32.23,67.31 U3.17 34.92,67.31 36.2,68.58 41.43,68.58 42.7,67.31 U2.17
A2
  Top 0.254: BUS.38 5.09,82.87 7.88,82.87 23.44,67.31 U3.4 30,67.31 31.27,66.04 35.24,66.04 36.51,67.31 U2.4
A3
  Top 0.254: BUS.37 8.44,81.59 23.99,66.04 28.42,66.04 32.23,62.23 U3.15 34.92,62.23 36.2,63.5 41.43,63.5 42.7,62.23 U2.15
A4
  Top 0.254: BUS.36 5.09,80.33 8.98,80.33 22.38,66.92 22.38,64.45 24.61,62.23 U3.6 29.84,62.23 31.11,60.96 35.24,60.96 36.51,62.23 U2.6
A5
  Top 0.254: BUS.35 9.54,79.05 21.88,66.72 21.88,64.24 25,61.12 28.42,61.12 32.38,57.15 U3.13 34.92,57.15 36.2,58.42 41.27,58.42 42.55,57.15 U2.13
A6
  Top 0.254: BUS.34 5.09,77.79 10.09,77.79 21.37,66.5 21.37,60.07 24.29,57.15 U3.8 29.69,57.15 30.96,55.88 35.24,55.88 36.51,57.15 U2.8
A7
  Top 0.254: BUS.33 10.64,76.51 20.86,66.29 20.86,57.4 24.92,53.34 29.53,53.34 30.8,52.07 U3.11 34.92,52.07 36.2,53.34 41.27,53.34 42.55,52.07 U2.11
CLK  (via drill 0.5)
  Top 0.254: BUS.5 15.81,40.95 19.42,37.34 80.14,37.34 v80.17,37.31 | v82.23,38.65 103.34,38.65 v103.38,38.61
  Bottom 0.254: v80.17,37.31 81.51,38.65 v82.23,38.65 | v103.38,38.61 103.38,52.36 102.87,52.86 102.87,54.61 U1.43
COL0_A
  Bottom 0.305: U9.5 149.86,90.17 150.97,91.28 150.97,112.21 150.5,112.69 150.5,114.89 CN1.16
COL0_B
  Bottom 0.305: U10.12 141.6,90.17 140.49,91.28 140.49,103.89 149.25,112.65 CN1.17
COL0_C
  Bottom 0.305: U10.10 141.6,85.09 139.38,87.32 139.38,104.36 146.71,111.69 CN1.19
COL0_D
  Bottom 0.305: U10.7 135.25,85.09 137.48,87.32 137.48,104.98 142.88,110.37 142.88,114.89 CN1.22
COL0_E
  Bottom 0.305: U10.6 135.25,87.63 136.93,89.3 136.93,105.21 141.63,109.92 CN1.23
COL0_F
  Bottom 0.305: U10.5 135.25,90.17 136.37,91.28 136.37,105.44 140.34,109.41 140.34,114.89 CN1.24
COL0_G
  Bottom 0.305: U9.12 156.21,90.17 155.1,91.28 155.1,108.27 159.41,112.58 CN1.9
COL0_H
  Bottom 0.305: U9.8 150.27,82.55 152.68,84.96 152.68,109.2 154.33,110.86 CN1.13
COL0_K
  Bottom 0.305: U9.7 150.81,85.09 152.09,86.38 152.09,109.51 153.06,110.47 153.06,114.92 CN1.14
COL0_M
  Bottom 0.305: U9.6 150.12,87.63 151.54,89.05 151.54,113.4 CN1.15
COL0_N
  Bottom 0.305: U10.11 141.6,87.63 139.94,89.3 139.94,104.12 147.96,112.14 147.96,114.89 CN1.18
COL0_P
  Bottom 0.305: U10.9 141.6,82.55 138.82,85.34 138.82,104.59 145.41,111.19 145.41,114.89 CN1.20
COL0_R
  Bottom 0.305: U10.8 135.25,82.55 138.04,85.34 138.04,104.75 144.17,110.88 CN1.21
COL0_S
  Bottom 0.305: U9.10 156.21,85.09 153.98,87.32 153.98,108.74 156.87,111.63 CN1.11
COL0_T
  Bottom 0.305: U9.11 156.21,87.63 154.54,89.3 154.54,108.5 158.12,112.07 158.12,114.89 CN1.10
COL0_U
  Bottom 0.305: U9.9 156.21,82.55 153.42,85.34 153.42,108.97 155.57,111.12 155.57,114.89 CN1.12
COL1_A
  Bottom 0.305: U11.5 166.37,24.13 169.16,21.34 169.16,11.3 167.32,9.46 167.32,5.1 CN3.5
COL1_B
  Bottom 0.305: U12.12 158.12,24.13 155.33,21.34 155.33,12.15 158.41,9.06 CN3.12
COL1_C
  Bottom 0.305: U12.10 158.12,19.05 156.44,17.38 156.44,12.62 160.95,8.12 CN3.10
COL1_D
  Bottom 0.305: U12.7 152.32,19.05 153.44,17.93 153.44,11.67 153.92,11.18 154.56,10.54 154.56,5.04 CN3.15
COL1_E
  Bottom 0.305: U12.6 151.76,21.59 153.99,19.36 153.99,11.9 155.87,10.02 CN3.14
COL1_F
  Bottom 0.305: U12.5 151.76,24.13 154.55,21.34 154.55,12.13 157.16,9.52 157.16,5.1 CN3.13
COL1_G
  Bottom 0.305: U11.12 172.72,24.13 169.93,21.34 169.93,10.77 168.59,9.43 168.59,6.37 CN3.4
COL1_H
  Bottom 0.305: U11.8 166.53,16.51 167.48,15.56 167.48,11.99 163.49,8 CN3.8
COL1_K
  Bottom 0.305: U11.7 166.37,19.05 168.04,17.38 168.04,11.76 164.78,8.5 164.78,5.1 CN3.7
COL1_M
  Bottom 0.305: U11.6 166.37,21.59 168.6,19.36 168.6,11.53 166.03,8.96 CN3.6
COL1_N
  Bottom 0.305: U12.11 158.12,21.59 155.89,19.36 155.89,12.39 159.7,8.57 159.7,5.1 CN3.11
COL1_P
  Bottom 0.305: U12.9 157.96,16.51 157,15.56 157,12.86 162.24,7.62 162.24,5.1 CN3.9
COL1_R
  Bottom 0.305: U12.8 151.92,16.51 152.88,15.56 152.88,11.44 153.33,10.98 CN3.16
COL1_S
  Bottom 0.305: U11.10 172.57,19.05 171.05,17.53 171.05,6.41 CN3.2
COL1_T
  Bottom 0.305: U11.11 172.72,21.59 170.49,19.36 170.49,10.54 169.86,9.91 169.86,5.1 CN3.3
COL1_U
  Bottom 0.305: CN3.1 172.4,5.1 172.4,9.81 171.61,10.6 171.61,15.62 172.5,16.51 U11.9
COL2_A
  Bottom 0.305: U13.5 120.65,90.17 121.76,91.28 121.76,103.73 126.24,108.2 128.78,108.2 130.18,109.6 130.18,114.89 CN1.32
COL2_B
  Bottom 0.305: U14.12 111.76,90.17 110.65,91.28 110.65,102.08 114.3,105.73 122.24,105.73 128.93,112.42 CN1.33
COL2_C
  Bottom 0.305: U14.10 111.76,85.09 109.53,87.32 109.53,102.54 113.84,106.84 120.82,106.84 126.39,112.41 CN1.35
COL2_D
  Bottom 0.305: U14.7 105.41,85.09 107.64,87.32 107.64,103.02 113.14,108.52 118.2,108.52 122.56,112.88 122.56,114.89 CN1.38
COL2_E
  Bottom 0.305: U14.6 105.41,87.63 107.08,89.3 107.08,103.25 112.91,109.08 117.97,109.08 121.31,112.42 CN1.39
COL2_F
  Bottom 0.305: U14.5 105.41,90.17 106.52,91.28 106.52,103.48 112.68,109.64 117.73,109.64 120.02,111.92 120.02,114.89 CN1.40
COL2_G
  Bottom 0.305: U13.12 127,90.17 125.89,91.28 125.89,102.32 127.86,104.29 130.4,104.29 138.35,112.25 138.35,112.91 CN1.25
COL2_H
  Bottom 0.305: U13.8 120.65,82.55 123.44,85.34 123.44,103.03 126.93,106.53 129.47,106.53 134.01,111.06 CN1.29
COL2_K
  Bottom 0.305: U13.7 120.65,85.09 122.88,87.32 122.88,103.26 126.7,107.09 129.24,107.09 132.72,110.56 132.72,114.89 CN1.30
COL2_M
  Bottom 0.305: U13.6 120.65,87.63 122.32,89.3 122.32,103.5 126.47,107.64 129.01,107.64 131.47,110.11 CN1.31
COL2_N
  Bottom 0.305: U14.11 111.76,87.63 110.09,89.3 110.09,102.31 114.07,106.29 121.05,106.29 127.64,112.87 127.64,114.89 CN1.34
COL2_P
  Bottom 0.305: U14.9 111.76,82.55 108.97,85.34 108.97,102.77 113.61,107.4 119.64,107.4 125.09,112.86 125.09,114.89 CN1.36
COL2_R
  Bottom 0.305: U14.8 105.41,82.55 108.2,85.34 108.2,102.79 113.37,107.96 119.41,107.96 123.85,112.41 CN1.37
COL2_S
  Bottom 0.305: U13.10 127,85.09 124.77,87.32 124.77,102.79 127.39,105.41 129.94,105.41 136.55,112.03 CN1.27
COL2_T
  Bottom 0.305: U13.11 127,87.63 125.33,89.3 125.33,102.55 127.63,104.85 130.17,104.85 137.79,112.48 137.79,114.89 CN1.26
COL2_U
  Bottom 0.305: U13.9 127,82.55 124.21,85.34 124.21,103.02 127.16,105.97 129.7,105.97 135.25,111.52 135.25,114.89 CN1.28
COL3_A
  Bottom 0.305: U15.5 137.16,24.13 139.95,21.34 139.95,12.44 136.84,9.34 136.84,5.1 CN3.29
COL3_B
  Bottom 0.305: U16.12 129.45,24.13 126.03,20.71 126.03,13.08 127.93,11.18 CN3.36
COL3_C
  Bottom 0.305: U16.10 128.91,19.05 127.23,17.38 127.23,13.55 130.47,10.31 CN3.34
COL3_D
  Bottom 0.305: U16.7 122.56,19.05 124.3,17.31 124.3,12.21 124.14,12.06 124.14,8.89 124.14,5.1 CN3.39
COL3_E
  Bottom 0.305: U16.6 123.16,21.59 124.85,19.9 124.85,12.56 125.39,12.02 CN3.38
COL3_F
  Bottom 0.305: U16.5 122.62,24.13 125.41,21.34 125.41,12.89 126.75,11.56 126.75,5.17 CN3.37
COL3_G
  Bottom 0.305: U15.12 143.51,24.13 140.72,21.34 140.72,12.14 138.09,9.51 CN3.28
COL3_H
  Bottom 0.305: U15.8 137.32,16.51 138.27,15.56 138.27,13.13 133.01,7.87 CN3.32
COL3_K
  Bottom 0.305: U15.7 137.16,19.05 138.83,17.38 138.83,12.9 134.3,8.38 134.3,5.1 CN3.31
COL3_M
  Bottom 0.305: U15.6 137.16,21.59 139.39,19.36 139.39,12.67 135.57,8.86 135.57,6.37 CN3.30
COL3_N
  Bottom 0.305: U16.11 128.91,21.59 126.68,19.36 126.68,13.32 129.22,10.77 129.22,5.1 CN3.35
COL3_P
  Bottom 0.305: U16.9 128.75,16.51 127.79,15.56 127.79,13.78 131.76,9.81 131.76,5.1 CN3.33
COL3_R
  Bottom 0.305: U16.8 122.71,16.51 123.74,15.49 123.74,12.45 122.85,11.56 CN3.40
COL3_S
  Bottom 0.305: U15.10 143.51,19.05 141.84,17.38 141.84,11.68 140.63,10.47 CN3.26
COL3_T
  Bottom 0.305: U15.11 143.51,21.59 141.28,19.36 141.28,11.91 139.38,10.02 139.38,5.1 CN3.27
COL3_U
  Bottom 0.305: U15.9 143.35,16.51 142.4,15.56 142.4,11.45 141.92,10.97 141.92,5.1 CN3.25
COL4_A
  Bottom 0.305: U17.5 71.75,90.17 72.87,91.28 72.87,101.6 71.75,102.71 63.5,102.71 | 63.47,102.71 63.5,102.71 | 63.47,102.71 63.5,102.71 | CN2.8 50.8,114.92 50.8,112.9 55.4,108.29 57.89,108.29 63.47,102.71
COL4_B
  Bottom 0.305: U18.12 63.5,90.17 62.39,91.28 62.39,103 57.66,107.73 52.75,107.73 49.53,110.95 CN2.9
COL4_C
  Bottom 0.305: U18.10 63.5,85.09 61.27,87.32 61.27,102.54 57.2,106.62 52.28,106.62 46.99,111.91 CN2.11
COL4_D
  Bottom 0.305: U18.7 57.15,85.09 59.38,87.32 59.38,102.06 56.5,104.94 50.95,104.94 43.18,112.71 43.18,114.92 CN2.14
COL4_E
  Bottom 0.305: U18.6 57.15,87.63 58.82,89.3 58.82,101.83 56.27,104.38 50.07,104.38 41.91,112.54 CN2.15
COL4_F
  Bottom 0.305: U18.5 57.15,90.17 58.26,91.28 58.26,101.6 56.04,103.82 49.77,103.82 40.64,112.95 40.64,114.92 CN2.16
COL4_G
  Bottom 0.305: U17.12 78.11,90.17 76.99,91.28 76.99,103 73.38,106.62 65.09,106.62 59.69,112.03 CN2.1
COL4_H
  Bottom 0.305: U17.8 71.75,82.55 74.54,85.34 74.54,102.29 72.45,104.39 64.17,104.39 58.59,109.97 56.82,109.97 54.61,112.18 CN2.5
COL4_K
  Bottom 0.305: U17.7 71.75,85.09 73.98,87.32 73.98,102.06 72.22,103.83 64.14,103.83 | 63.94,103.83 64.14,103.83 | CN2.6 53.34,114.92 53.34,112.02 55.95,109.41 58.35,109.41 63.94,103.83 | 64.14,103.83 63.94,103.83
COL4_M
  Bottom 0.305: U17.6 71.75,87.63 73.42,89.3 73.42,101.83 71.99,103.27 63.7,103.27 58.12,108.85 55.72,108.85 52.07,112.5 CN2.7
COL4_N
  Bottom 0.305: U18.11 63.5,87.63 61.83,89.3 61.83,102.77 57.43,107.17 52.52,107.17 48.26,111.43 48.26,114.92 CN2.10
COL4_P
  Bottom 0.305: U18.9 63.5,82.55 60.71,85.34 60.71,102.31 56.97,106.06 52.05,106.06 45.72,112.39 45.72,114.92 CN2.12
COL4_R
  Bottom 0.305: U18.8 57.15,82.55 59.94,85.34 59.94,102.29 56.73,105.5 51.82,105.5 44.45,112.87 CN2.13
COL4_S
  Bottom 0.305: U17.10 78.11,85.09 75.88,87.32 75.88,102.54 72.91,105.5 64.63,105.5 57.15,112.98 CN2.3
COL4_T
  Bottom 0.305: U17.11 78.11,87.63 76.44,89.3 76.44,102.77 73.14,106.06 64.86,106.06 58.42,112.5 58.42,114.92 CN2.2
COL4_U
  Bottom 0.305: U17.9 78.11,82.55 75.32,85.34 75.32,102.31 72.68,104.95 64.4,104.95 58.82,110.53 57.75,110.53 55.88,112.39 55.88,114.92 CN2.4
COL5_A
  Bottom 0.305: U19.5 46.99,24.13 49.78,21.34 49.78,11.35 53.34,7.79 53.34,5.08 CN4.5
COL5_B
  Bottom 0.305: U20.12 38.73,24.13 35.95,21.34 35.95,13.12 38.52,10.55 41.27,10.55 44.45,7.37 CN4.12
COL5_C
  Bottom 0.305: U20.10 38.73,19.05 37.06,17.38 37.06,13.58 38.98,11.66 42.63,11.66 46.99,7.31 CN4.10
COL5_D
  Bottom 0.305: U20.7 32.38,19.05 34.05,17.38 34.05,12.64 37.82,8.87 39.7,8.87 40.64,7.93 40.64,5.08 CN4.15
COL5_E
  Bottom 0.305: U20.6 32.38,21.59 34.61,19.36 34.61,12.87 38.05,9.43 39.93,9.43 41.91,7.45 CN4.14
COL5_F
  Bottom 0.305: U20.5 32.38,24.13 35.17,21.34 35.17,13.1 38.28,9.99 40.16,9.99 43.18,6.97 43.18,5.08 CN4.13
COL5_G
  Bottom 0.305: U19.12 53.34,24.13 50.55,21.34 50.55,11.37 54.61,7.31 CN4.4
COL5_H
  Bottom 0.305: U19.8 47.15,16.51 48.1,15.56 48.1,10.66 49.53,9.23 CN4.8
COL5_K
  Bottom 0.305: U19.7 46.99,19.05 48.66,17.38 48.66,10.89 50.8,8.75 50.8,5.08 CN4.7
COL5_M
  Bottom 0.305: U19.6 46.99,21.59 49.22,19.36 49.22,11.12 52.07,8.27 CN4.6
COL5_N
  Bottom 0.305: U20.11 38.73,21.59 36.51,19.36 36.51,13.35 38.75,11.11 41.6,11.11 45.72,6.99 45.72,5.08 CN4.11
COL5_P
  Bottom 0.305: U20.9 38.58,16.51 37.62,15.56 37.62,13.81 39.21,12.22 42.86,12.22 48.26,6.83 48.26,5.08 CN4.9
COL5_R
  Bottom 0.305: U20.8 32.54,16.51 33.5,15.56 33.5,12.41 39.37,6.53 CN4.16
COL5_S
  Bottom 0.305: U19.10 53.34,19.05 51.67,17.38 51.67,11.83 CN4.2
COL5_T
  Bottom 0.305: U19.11 53.34,21.59 51.11,19.36 51.11,11.6 55.78,6.93 55.78,5.87 54.61,4.7 CN4.3
COL5_U
  Bottom 0.305: U19.9 53.18,16.51 52.23,15.56 52.23,12.06 56.19,8.1 57.31,8.1 58.42,6.99 58.42,5.08 CN4.1
COL6_A
  Bottom 0.305: U21.5 42.55,90.17 43.66,91.28 43.66,102.08 35.88,109.86 33.5,109.86 30.48,112.87 30.48,114.92 CN2.24
COL6_B
  Bottom 0.305: U22.12 34.29,90.17 33.18,91.28 33.18,103.98 29.21,107.95 CN2.25
COL6_C
  Bottom 0.305: U22.10 34.29,85.09 32.06,87.32 32.06,103.52 26.67,108.91 CN2.27
COL6_D
  Bottom 0.305: U22.7 27.94,85.09 30.17,87.32 30.17,103.02 22.86,110.33 22.86,114.92 CN2.30
COL6_E
  Bottom 0.305: U22.6 27.94,87.63 29.61,89.3 29.61,102.79 21.59,110.81 CN2.31
COL6_F
  Bottom 0.305: U22.5 27.94,90.17 29.05,91.28 29.05,102.55 20.32,111.28 20.32,114.92 CN2.32
COL6_G
  Bottom 0.305: U21.12 48.9,90.17 47.78,91.28 47.78,103.48 39.37,111.89 CN2.17
COL6_H
  Bottom 0.305: U21.8 42.55,82.55 45.33,85.34 45.33,102.77 36.34,111.76 34.92,111.76 34.29,112.39 CN2.21
COL6_K
  Bottom 0.305: U21.7 42.55,85.09 44.77,87.32 44.77,102.54 36.19,111.12 33.81,111.12 33.02,111.91 33.02,114.3 33.02,114.92 CN2.22
COL6_M
  Bottom 0.305: U21.6 42.55,87.63 44.22,89.3 44.22,102.23 | 44.22,102.31 44.22,102.23 | CN2.23 31.75,112.39 33.73,110.41 36.11,110.41 44.22,102.31 | 44.22,102.31 44.22,102.23
COL6_N
  Bottom 0.305: U22.11 34.29,87.63 32.62,89.3 32.62,103.75 27.94,108.43 27.94,114.92 CN2.26
COL6_P
  Bottom 0.305: U22.9 34.29,82.55 31.5,85.34 31.5,103.28 25.4,109.38 25.4,114.92 CN2.28
COL6_R
  Bottom 0.305: U22.8 28.1,82.55 30.73,85.18 30.73,103.26 24.13,109.86 CN2.29
COL6_S
  Bottom 0.305: U21.10 48.9,85.09 46.67,87.32 46.67,103.02 36.83,112.85 CN2.19
COL6_T
  Bottom 0.305: U21.11 48.9,87.63 47.23,89.3 47.23,103.25 38.1,112.37 38.1,114.92 CN2.18
COL6_U
  Bottom 0.305: U21.9 48.9,82.55 46.11,85.34 46.11,102.79 36.58,112.32 36.2,112.32 35.56,112.95 35.56,114.92 CN2.20
COL7_A
  Bottom 0.305: U23.5 13.34,90.17 14.45,91.28 14.45,101.6 14.43,101.62 14.43,106.22 10.16,110.49 10.16,114.92 CN2.40
COL7_B
  Bottom 0.305: U24.12 24.13,24.13 21.34,21.34 21.34,13.12 24.23,10.23 31.43,10.23 34.29,7.37 CN4.20
COL7_C
  Bottom 0.305: U24.10 24.13,19.05 22.46,17.38 22.46,13.58 24.69,11.35 32.82,11.35 36.83,7.33 CN4.18
COL7_D
  Bottom 0.305: U24.7 17.78,19.05 19.45,17.38 19.45,12.64 23.54,8.55 29.69,8.55 30.48,7.76 30.48,5.08 CN4.23
COL7_E
  Bottom 0.305: U24.6 17.78,21.59 20.01,19.36 20.01,12.87 23.77,9.11 30.42,9.11 31.75,7.78 CN4.22
COL7_F
  Bottom 0.305: U24.5 17.78,24.13 20.57,21.34 20.57,13.1 24,9.67 30.65,9.67 33.02,7.3 33.02,5.08 CN4.21
COL7_G
  Bottom 0.305: U23.12 19.68,90.17 18.57,91.28 18.57,102.55 18.57,103 18.34,103.24 18.34,107.7 19.05,108.41 CN2.33
COL7_H
  Bottom 0.305: U23.8 13.34,82.55 16.12,85.34 16.12,102.29 16.1,102.31 16.1,106.93 13.97,109.06 CN2.37
COL7_K
  Bottom 0.305: U23.7 13.34,85.09 15.56,87.32 15.56,102.06 15.54,102.08 15.54,106.69 12.7,109.54 12.7,114.92 CN2.38
COL7_M
  Bottom 0.305: U23.6 13.34,87.63 15.01,89.3 15.01,101.76 | 15.01,101.83 15.01,101.76 | CN2.39 11.43,110.01 14.99,106.46 14.99,101.85 15.01,101.83 | 15.01,101.83 15.01,101.76
COL7_N
  Bottom 0.305: U24.11 24.13,21.59 21.9,19.36 21.9,13.35 24.46,10.79 31.79,10.79 35.56,7.02 35.56,5.08 CN4.19
COL7_P
  Bottom 0.305: U24.9 23.97,16.51 23.02,15.56 23.02,13.81 24.92,11.91 33.05,11.91 38.1,6.85 38.1,5.08 CN4.17
COL7_R
  Bottom 0.305: U24.8 17.94,16.51 18.89,15.56 18.89,12.41 23.3,8 28.52,8 29.21,7.3 CN4.24
COL7_S
  Bottom 0.305: U23.10 19.68,85.09 17.46,87.32 17.46,102.54 17.22,102.78 17.22,107.39 16.51,108.11 CN2.35
COL7_T
  Bottom 0.305: U23.11 19.68,87.63 18.02,89.3 18.02,102.77 17.78,103.01 17.78,114.92 CN2.34
COL7_U
  Bottom 0.305: U23.9 19.68,82.55 16.9,85.34 16.9,102.31 16.66,102.55 16.66,107.16 15.24,108.58 15.24,114.92 CN2.36
D0
  Top 0.254: BUS.30 5.09,72.71 8.81,72.71 13.24,68.28 13.24,52.64 19.21,46.67 61.59,46.67 64.93,50.01 64.93,63.82 69.69,68.58 U6.2 74.61,68.58 75.88,67.31 85.09,67.31 U1.18
D1
  Top 0.254: BUS.29 9.37,71.43 12.73,68.07 12.73,52.43 19,46.16 61.8,46.16 65.44,49.8 65.44,61.91 69.56,66.04 U6.3 74.61,66.04 75.88,64.77 87.63,64.77 U1.19
D2
  Top 0.254: BUS.28 5.09,70.17 7.7,70.17 12.22,65.65 12.22,52.22 18.79,45.66 62.02,45.66 65.94,49.59 65.94,59.85 69.6,63.5 U6.4 74.61,63.5 75.88,62.23 85.09,62.23 U1.20
D3
  Top 0.254: BUS.27 8.26,68.89 11.72,65.44 11.72,52.01 18.58,45.15 62.23,45.15 66.45,49.38 66.45,57.89 69.52,60.96 U6.5 74.45,60.96 75.72,59.69 83.5,59.69 86.04,62.23 87.63,62.23 U1.21
D4
  Top 0.254: BUS.26 5.09,67.63 7.07,67.63 11.21,63.49 11.21,51.8 18.37,44.64 62.44,44.64 66.96,49.16 66.96,55.82 69.56,58.42 U6.6 74.45,58.42 75.72,57.15 85.09,57.15 U1.24
D5
  Top 0.254: BUS.25 7.63,66.35 10.7,63.28 10.7,51.59 18.16,44.13 62.65,44.13 67.47,48.95 67.47,53.75 69.6,55.88 U6.7 74.45,55.88 75.88,54.45 83.19,54.45 85.88,57.15 87.63,57.15 U1.25
D6
  Top 0.254: BUS.24 5.09,65.09 7.39,65.09 10.19,62.28 10.19,51.38 17.95,43.62 62.86,43.62 67.98,48.74 67.98,51.69 69.63,53.34 U6.8 74.45,53.34 75.72,52.07 82.55,52.07 U1.26
D7
  Top 0.254: BUS.23 7.95,63.81 9.68,62.07 9.68,51.17 17.74,43.12 63.07,43.12 68.48,48.53 68.48,49.69 69.6,50.8 U6.9 74.45,50.8 75.72,49.53 80.8,49.53 85.88,54.61 87.63,54.61 U1.27
DP0
  Bottom 0.305: U8.5 165.1,90.17 166.21,91.28 166.21,103.78 160.66,109.34 160.66,114.89 CN1.8
DP1
  Bottom 0.305: U8.6 165.1,87.63 166.77,89.3 166.77,104.01 161.95,108.83 CN1.7
DP2
  Bottom 0.305: U8.7 165.1,85.09 167.33,87.32 167.33,104.24 163.19,108.38 163.19,114.89 CN1.6
DP3
  Bottom 0.305: U8.8 167.92,86 167.92,87.63 167.92,104.51 164.49,107.94 CN1.5
DP4
  Bottom 0.305: U8.9 171.45,82.55 168.66,85.34 168.66,104.62 165.74,107.55 165.74,114.89 CN1.4
DP5
  Bottom 0.305: U8.10 171.45,85.09 169.22,87.32 169.22,104.85 167.03,107.04 CN1.3
DP6
  Bottom 0.305: U8.11 171.45,87.63 169.78,89.3 169.78,105.08 168.28,106.59 168.28,114.89 CN1.2
DP7
  Bottom 0.305: U8.12 171.5,90.17 170.36,91.32 170.36,101.58 170.34,101.6 170.34,105.31 169.57,106.08 CN1.1
GND
  pour Route2: -6.35,127 189.23,127 189.23,-6.35 -6.35,-6.35
N$1
  Top 0.254: U23.3 15.88,95.25 17.14,93.98 24.45,93.98 25.72,95.25 U22.3 30.48,95.25 31.75,93.98 39.05,93.98 40.32,95.25 41.27,95.25 U21.3 45.09,95.25 46.35,93.98 53.66,93.98 54.93,95.25 U18.3 59.69,95.25 60.96,93.98 68.26,93.98 69.53,95.25 U17.3 74.3,95.25 75.56,93.98 101.92,93.98 103.19,95.25 U14.3 107.95,95.25 109.22,93.98 116.52,93.98 117.79,95.25 U13.3 123.19,95.25 124.46,93.98 131.76,93.98 133.03,95.25 U10.3 137.79,95.25 139.06,93.98 146.37,93.98 147.64,95.25 U9.3 152.4,95.25 153.67,93.98 161.61,93.98 162.88,95.25 U8.3 | U24.3 20.32,29.21 21.59,27.94 28.89,27.94 30.16,29.21 31.11,29.21 U20.3 34.77,29.21 36.04,27.94 43.5,27.94 44.77,29.21 U19.3 49.37,29.21 50.64,27.94 80.49,27.94 81.76,26.67 | U11.3 164.15,29.21 162.88,27.94 155.42,27.94 154.15,29.21 U12.3 149.54,29.21 148.27,27.94 140.81,27.94 139.54,29.21 U15.3 134.94,29.21 133.67,27.94 126.21,27.94 124.94,29.21 U16.3 118.75,29.21 113.35,23.81 113.35,18.1 110.49,15.24 100.97,15.24 99.69,16.51 U4.6 94.46,16.51 93.19,17.78 90.17,17.78 85.09,22.86 82.61,22.86 81.82,23.65 81.82,26.61 81.76,26.67 | U5.2 81.76,26.67
  Bottom 0.254: U21.3 41.27,95.25 40.01,93.98 40.01,80.64 38.73,79.38 33.02,79.38 31.75,78.11 31.75,72.39 | U3.19 31.75,72.39 | 31.75,72.39 31.75,69.85 31.75,38.1 34.29,35.56 34.29,29.84 33.66,29.21 U20.3
N$3
  Top 0.254: U7.14 79.53,24.13 80.8,22.86 80.8,18.73 79.85,17.78 76.04,17.78 73.5,15.24 62.47,15.24 57.01,9.78 18.03,9.78 16.51,8.26 CN4.34
N$4
  Bottom 0.254: U7.1 73.03,29.21 74.3,30.48 74.3,66.67 76.2,68.58 U6.19
N$5
  Bottom 0.254: U7.2 73.82,26.67 74.8,27.65 74.8,64.96 75.88,66.04 U6.18
N$6
  Top 0.254: U7.13 75.41,21.59 74.14,20.32 66.04,20.32 56.52,10.79 15.63,10.79 12.7,7.86 12.7,5.08 CN4.35
N$7
  Top 0.254: U7.12 75.41,19.05 74.14,17.78 64.29,17.78 56.8,10.29 15.84,10.29 13.97,8.41 CN4.36
N$8
  Bottom 0.305: R1.2 175.26,93.74 176.33,94.81 176.33,95.69 174.23,97.79 U8.15
N$17
  Bottom 0.305: R3.2 160.66,93.74 161.72,94.81 161.72,95.69 159.62,97.79 U9.15
N$18
  Bottom 0.305: R4.2 145.41,93.74 146.48,94.81 146.48,95.69 144.38,97.79 U10.15
N$19
  Bottom 0.305: R5.2 176.53,27.7 177.6,28.77 177.6,29.65 175.5,31.75 U11.15
N$20
  Bottom 0.305: R6.2 161.93,27.7 162.99,28.77 162.99,29.65 160.89,31.75 U12.15
N$21
  Bottom 0.305: R7.2 130.81,93.74 131.88,94.81 131.88,95.69 129.78,97.79 U13.15
N$22
  Bottom 0.305: R8.2 115.57,93.74 116.64,94.81 116.64,95.69 114.54,97.79 U14.15
N$23
  Bottom 0.305: R9.2 147.32,27.7 148.39,28.77 148.39,29.65 146.29,31.75 U15.15
N$24
  Bottom 0.305: R10.2 132.72,27.7 133.78,28.77 133.78,29.65 131.68,31.75 U16.15
N$25
  Bottom 0.305: R11.2 81.92,93.74 82.98,94.81 82.98,95.69 80.88,97.79 U17.15
N$26
  Bottom 0.305: R12.2 67.31,93.74 68.38,94.81 68.38,95.69 66.28,97.79 U18.15
N$27
  Bottom 0.305: R13.2 57.15,27.7 58.22,28.77 58.22,29.65 56.12,31.75 U19.15
N$28
  Bottom 0.305: R14.2 42.55,27.7 43.61,28.77 43.61,29.65 41.51,31.75 U20.15
N$29
  Bottom 0.305: R15.2 52.7,93.74 53.77,94.81 53.77,95.69 51.67,97.79 U21.15
N$30
  Bottom 0.305: R16.2 38.1,93.74 39.17,94.81 39.17,95.69 37.07,97.79 U22.15
N$31
  Bottom 0.305: R17.2 23.5,93.74 24.56,94.81 24.56,95.69 22.46,97.79 U23.15
N$32
  Bottom 0.305: R18.2 27.94,27.7 29.01,28.77 29.01,29.65 26.91,31.75 U24.15
N$33
  Top 0.254: U9.2 152.56,97.79 153.83,96.52 167.64,96.52 168.91,95.25 U8.14
N$34
  Top 0.254: U10.2 137.79,97.79 139.06,96.52 143.83,96.52 144.62,97.31 147.32,97.31 148.11,96.52 152.4,96.52 153.67,95.25 U9.14
N$35  (via drill 0.5)
  Top 0.254: U10.14 143.67,95.25 144.78,96.36 147.03,96.36 v147.09,96.3
  Bottom 0.254: v147.09,96.3 147.09,95.16 147.32,94.93 147.32,76.2 163.67,59.85 163.67,33.02 164.94,31.75 U11.2
N$36
  Top 0.254: U12.2 154.15,31.75 155.42,30.48 168.75,30.48 170.02,29.21 U11.14
N$37
  Top 0.254: U14.2 107.95,97.79 109.22,96.52 113.98,96.52 114.78,97.31 117.95,97.31 118.75,96.52 123.19,96.52 124.46,95.25 U13.14
N$38  (via drill 0.5)
  Top 0.254: U14.14 113.79,95.25 114.9,96.36 v117.32,96.36 | v123.04,37.74 132.75,37.74 134.3,36.2 134.3,33.18 135.73,31.75 U15.2
  Bottom 0.254: v117.32,96.36 117.76,95.92 117.76,92.69 117.09,92.02 117.09,73.09 121.76,68.42 121.76,39.28 121.4,38.92 121.4,38.23 121.89,37.74 v123.04,37.74
N$39
  Top 0.254: U16.2 124.94,31.75 126.21,30.48 139.54,30.48 140.81,29.21 U15.14
N$40
  Top 0.254: U18.2 59.69,97.79 60.96,96.52 65.88,96.52 67.03,97.67 69.02,97.67 70.17,96.52 74.3,96.52 75.56,95.25 U17.14
N$41  (via drill 0.5)
  Top 0.254: U18.14 65.41,95.25 66.99,96.84 v68.54,96.84
  Bottom 0.254: v68.54,96.84 68.91,96.47 68.91,82.09 66.36,79.53 44.29,79.53 42.42,77.66 42.42,38.59 44.17,36.83 44.64,36.83 45.12,36.34 45.12,35.65 44.61,35.13 44.61,32.86 45.72,31.75 U19.2
N$42
  Top 0.254: U20.2 34.77,31.75 36.04,30.48 49.37,30.48 50.64,29.21 U19.14
N$43
  Top 0.254: U22.2 30.48,97.79 31.75,96.52 45.09,96.52 46.35,95.25 U21.14
N$44
  Top 0.254: U23.2 15.88,97.79 17.14,96.52 21.27,96.52 22.11,97.35 25.52,97.35 26.35,96.52 30.48,96.52 31.75,95.25 U22.14
N$45  (via drill 0.5)
  Top 0.254: v25.08,96.52 22.86,96.52 21.59,95.25 U23.14
  Bottom 0.254: v25.08,96.52 25.24,96.36 25.24,81.6 26.99,79.85 29.05,79.85 30.73,78.17 30.73,38.2 28.26,35.72 23.02,35.72 19.05,31.75 U24.2
N$53  (via drill 0.35)
  Top 0.254: U23.4 15.88,92.71 17.14,91.44 24.45,91.44 25.72,92.71 U22.4 30.48,92.71 31.75,91.44 39.05,91.44 40.32,92.71 U21.4 45.09,92.71 46.35,91.44 53.66,91.44 54.93,92.71 U18.4 59.69,92.71 60.96,91.44 68.26,91.44 69.53,92.71 U17.4 74.3,92.71 75.56,91.44 101.92,91.44 103.19,92.71 U14.4 107.95,92.71 109.22,91.44 116.52,91.44 117.79,92.71 v119.22,92.71 U13.4 123.19,92.71 124.46,91.44 131.76,91.44 133.03,92.71 U10.4 137.79,92.71 139.06,91.44 146.37,91.44 147.64,92.71 U9.4 152.4,92.71 153.67,91.44 161.61,91.44 162.88,92.71 U8.4 | U24.4 20.32,26.67 21.59,25.4 28.89,25.4 30.16,26.67 U20.4 34.77,26.67 36.04,25.4 43.5,25.4 44.77,26.67 U19.4 49.53,26.67 50.8,25.4 80.17,25.4 81.31,24.26 81.31,21.43 82.42,20.32 85.09,20.32 90.17,15.24 99.69,15.24 100.97,13.97 U4.8 109.94,13.97 113.86,17.89 113.86,23.53 117,26.67 U16.4 123.83,26.67 124.94,26.67 126.21,25.4 133.67,25.4 134.94,26.67 U15.4 139.54,26.67 140.81,25.4 148.27,25.4 149.54,26.67 U12.4 154.15,26.67 155.42,25.4 162.88,25.4 164.15,26.67 U11.4
  Bottom 0.254: U13.4 v119.22,92.71 118.11,91.6 118.11,73.51 122.78,68.84 122.78,39.22 123.88,38.12 123.88,27.99 122.56,26.67 U16.4
N$55  (via drill 0.5)
  Top 0.254: v122.24,38.58 v154.78,38.58
  Bottom 0.254: U13.2 119.22,97.79 118.27,96.84 118.27,92.48 117.6,91.81 117.6,73.3 122.27,68.63 122.27,38.61 v122.24,38.58 | v154.78,38.58 154.78,30.16 155.73,29.21 U12.14
N$56  (via drill 0.5)
  Top 0.254: v122.12,70.68 121.48,70.04 106.17,70.04 105.73,70.48 82.55,70.48 80.64,72.39 71.12,72.39 v70.48,73.03
  Bottom 0.254: U16.14 125.66,29.21 124.39,30.48 124.39,38.33 123.28,39.43 123.28,69.05 122.12,70.22 v122.12,70.68 | v70.48,73.03 70.48,79.38 69.42,80.44 69.42,96.88 70.33,97.79 U17.2
N$57
  Bottom 0.254: U21.2 41.27,97.79 39.7,96.22 39.7,94.39 39.5,94.19 39.5,80.86 38.52,79.88 32.81,79.88 31.24,78.31 31.24,37.91 29.21,35.88 29.21,30.2 29.54,29.87 29.54,28.88 30.48,27.94 34.92,27.94 36.2,29.21 U20.14
N$177  (via drill 0.5)
  Top 0.254: U4.3 94.46,24.13 93.19,22.86 90.17,22.86 85.09,27.94 82.47,27.94 80.3,30.11 80.3,35.19 79.17,36.32 44.62,36.32 v44.29,36 | U3.1 30,74.93 31.27,73.66 35.24,73.66 36.51,74.93 U2.1
  Bottom 0.254: v44.29,36 41.91,38.38 41.91,73.82 40.8,74.93 U2.1
SCK
  Bottom 0.254: U1.5 100.33,62.23 100.33,22.86 99.06,21.59 U4.4
SDO  (via drill 0.5)
  Top 0.254: v105.41,69.53 163.04,69.53 v163.19,69.69
  Bottom 0.254: U8.2 162.88,97.79 162.56,97.47 162.56,70.33 v163.19,69.69 | U1.4 105.41,64.77 v105.41,69.53
TCK
  Top 0.254: U1.32 92.71,52.07 113.03,52.07 JTAG.1 119.54,54.61 120.65,55.72 R21.2
TDI
  Top 0.254: U1.7 111.76,68.58 JTAG.9 119.54,64.77 120.65,63.66 R20.1
TDO
  Top 0.254: U1.38 100.33,54.61 110.97,54.61 112.24,55.88 114.3,55.88 JTAG.3
TMS
  Top 0.254: U1.13 95.25,67.31 109.86,67.31 110.81,66.36 110.81,62.39 112.24,60.96 114.3,60.96 JTAG.5 R19.1

### Text on the board
tPlace: ADDR / ---- / 0x20 / 0x21 | FUNCTION / ------- / SHIFTER / CONTROL REG